# EasyEDA Pro project skyrizz_e32_se050.epro, schematic Schematic1_8

## Sheets
1 MCU & MEMORY: Board Name: ESP32-S3_TFT; Create Date: 2026-02-07; Page Name: MCU & MEMORY; Project Name: S3 SuperMini LCD; Schematic Name: Schematic1_4; Update Date: 2026-02-18; Company: EasyEDA.com; Page Size: A4; Version: V1.0
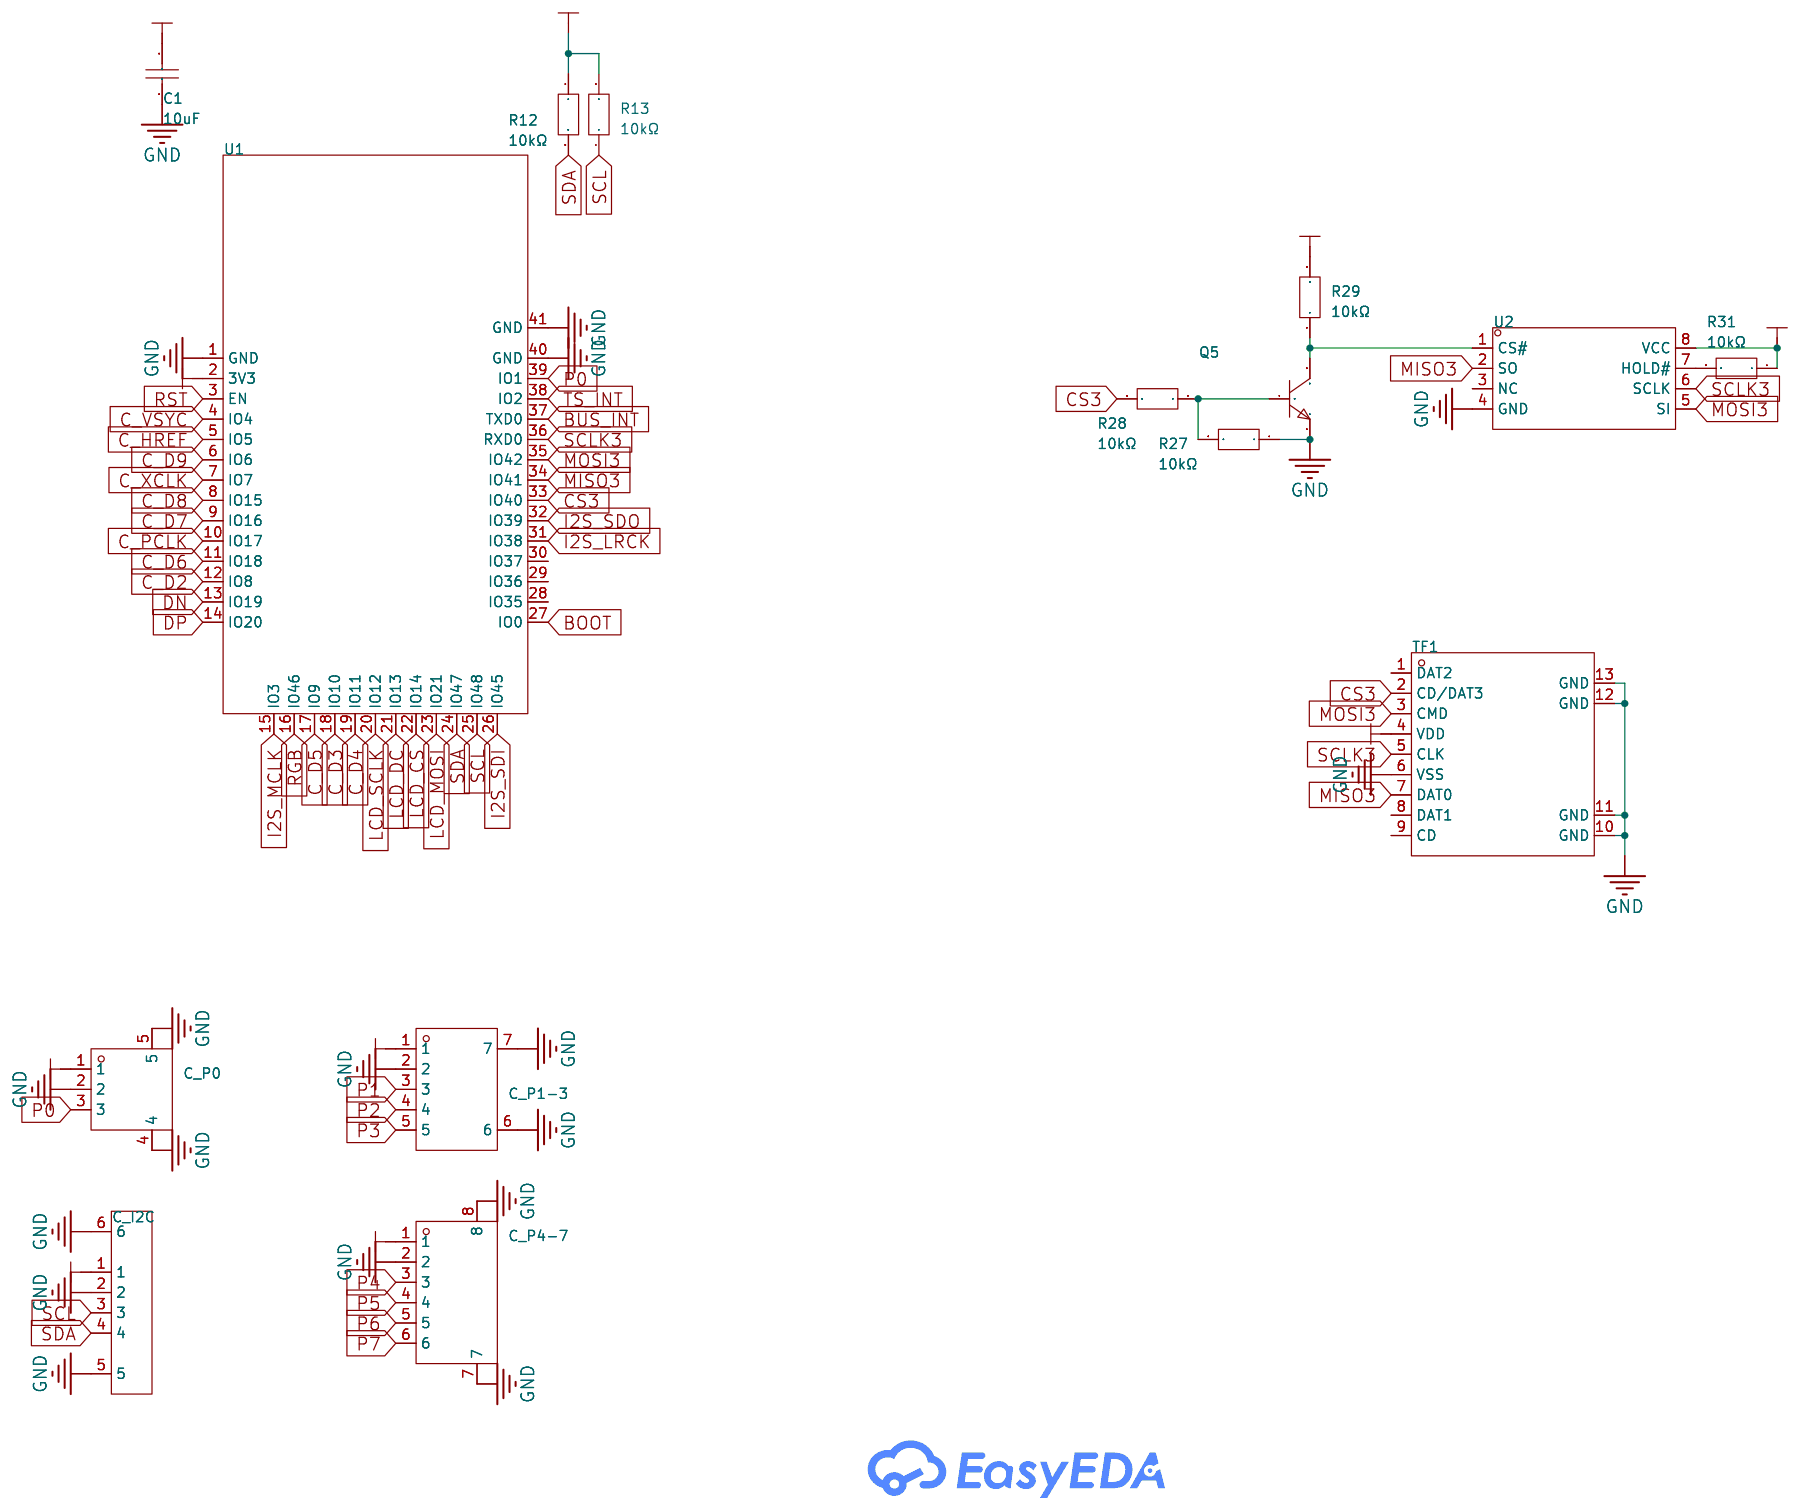
[diagram p0: MCU & MEMORY]
2 POWER: Create Date: 2026-02-15; Page Name: POWER; Update Date: 2026-02-19
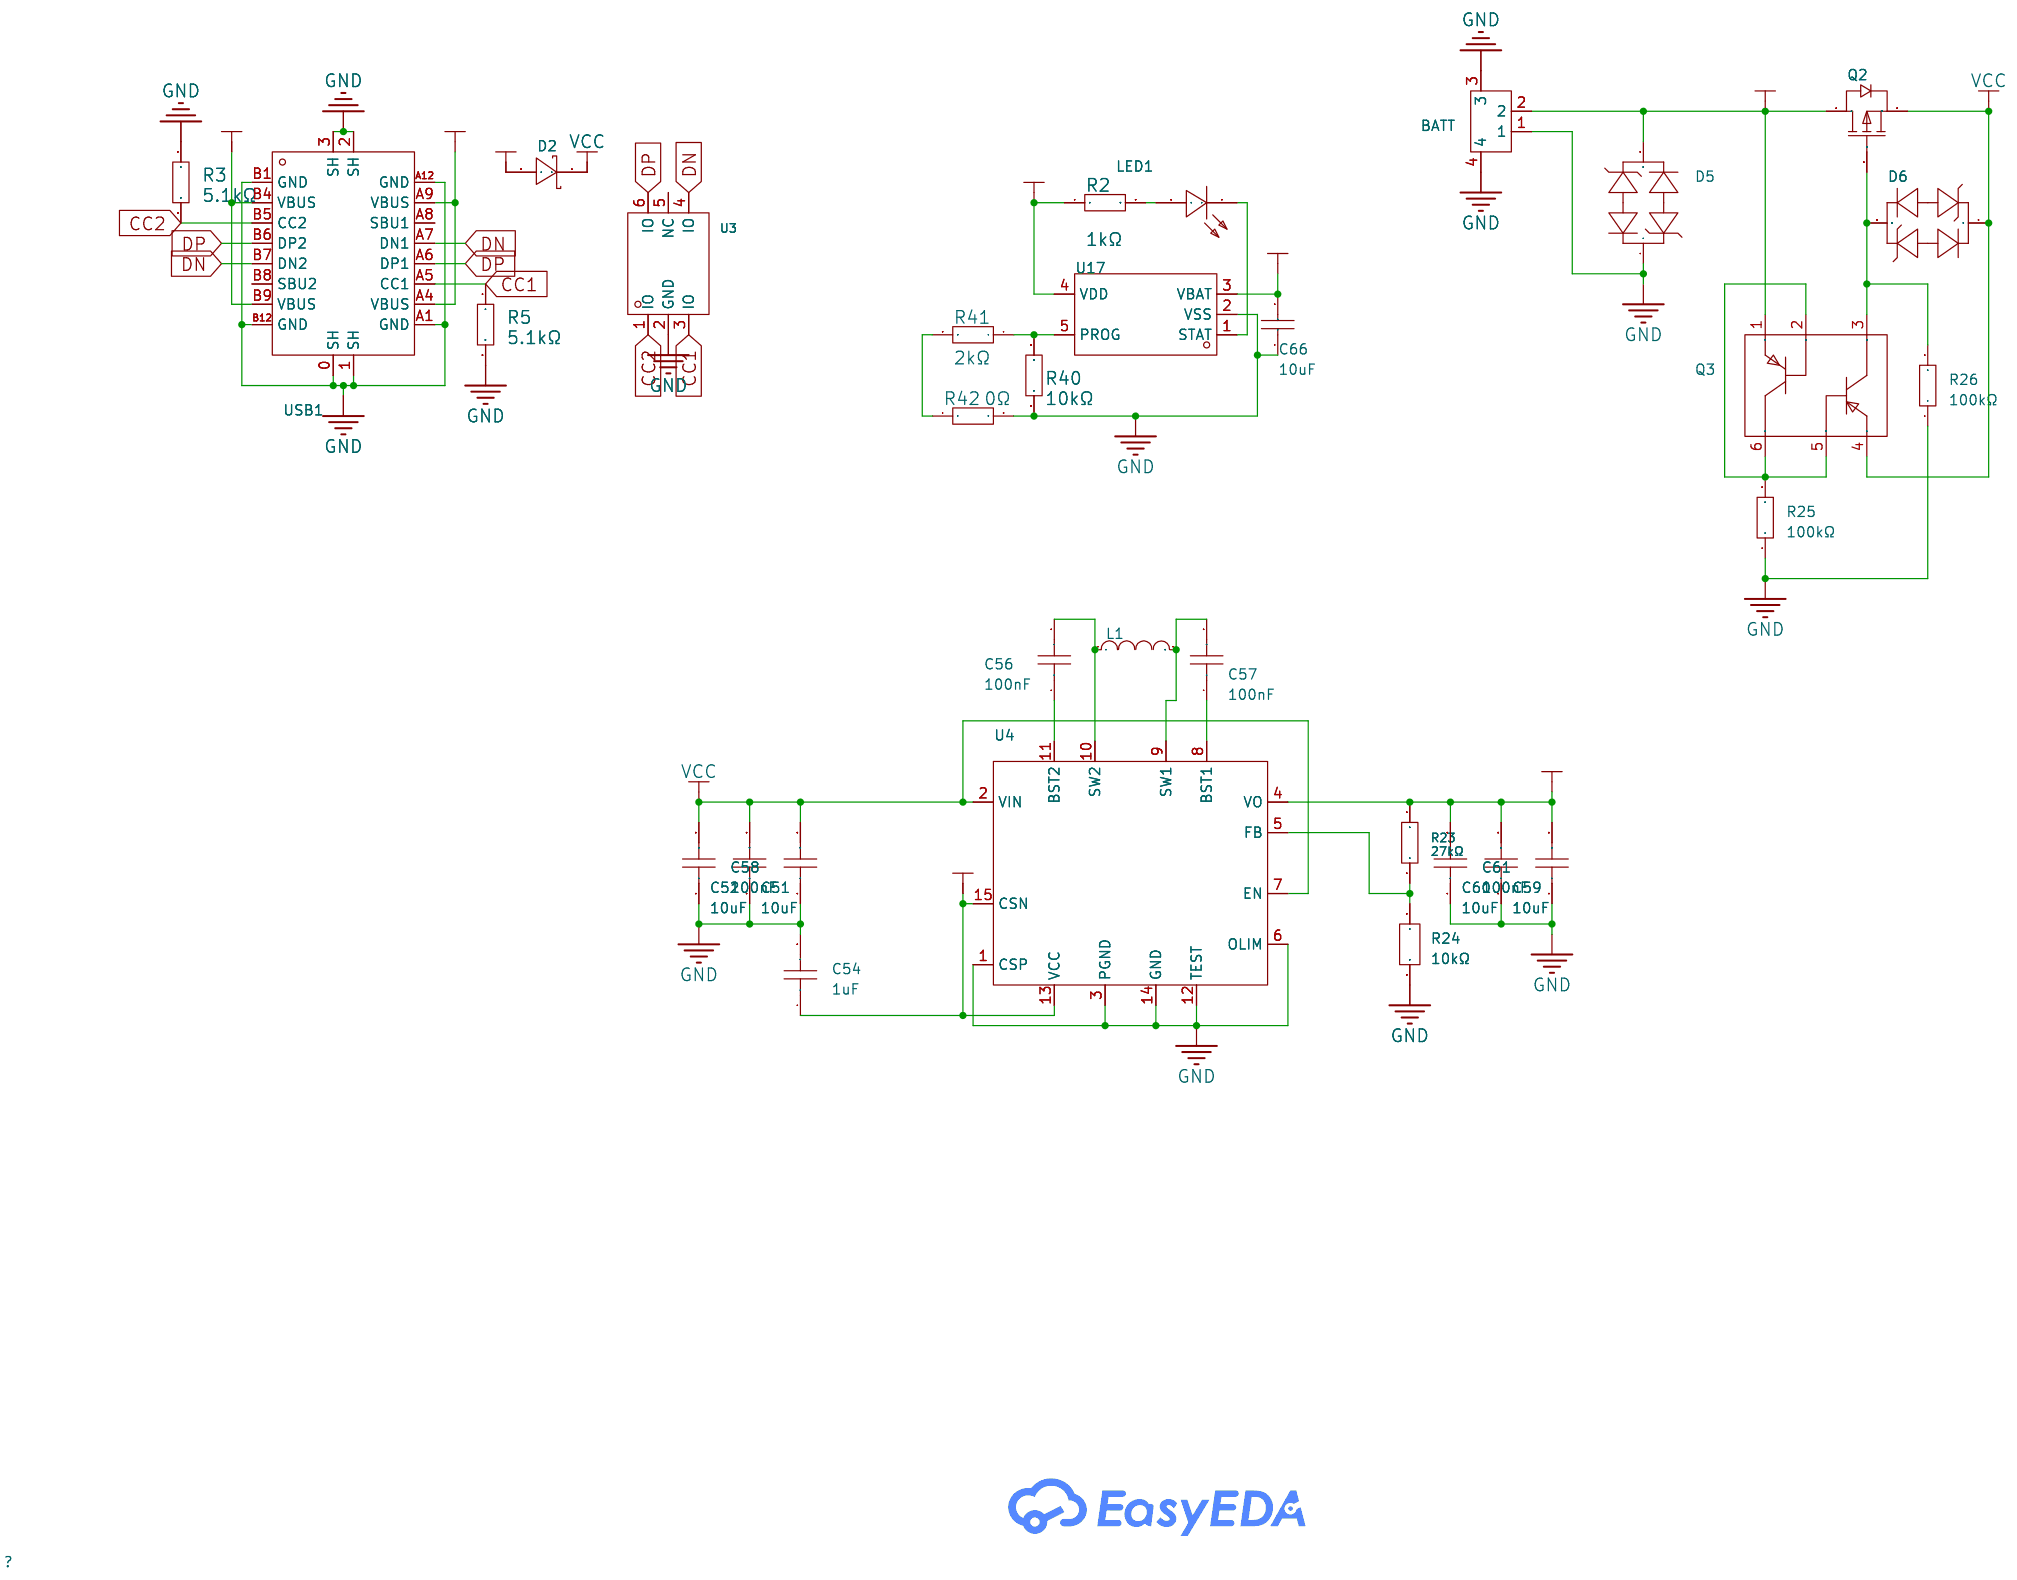
[diagram p1: POWER]
3 SENSOR I2C: Board Name: skyrizz_e32; Create Date: 2026-02-26; Page Name: SENSOR I2C; Schematic Name: Schematic1_8; Update Date: 2026-02-26
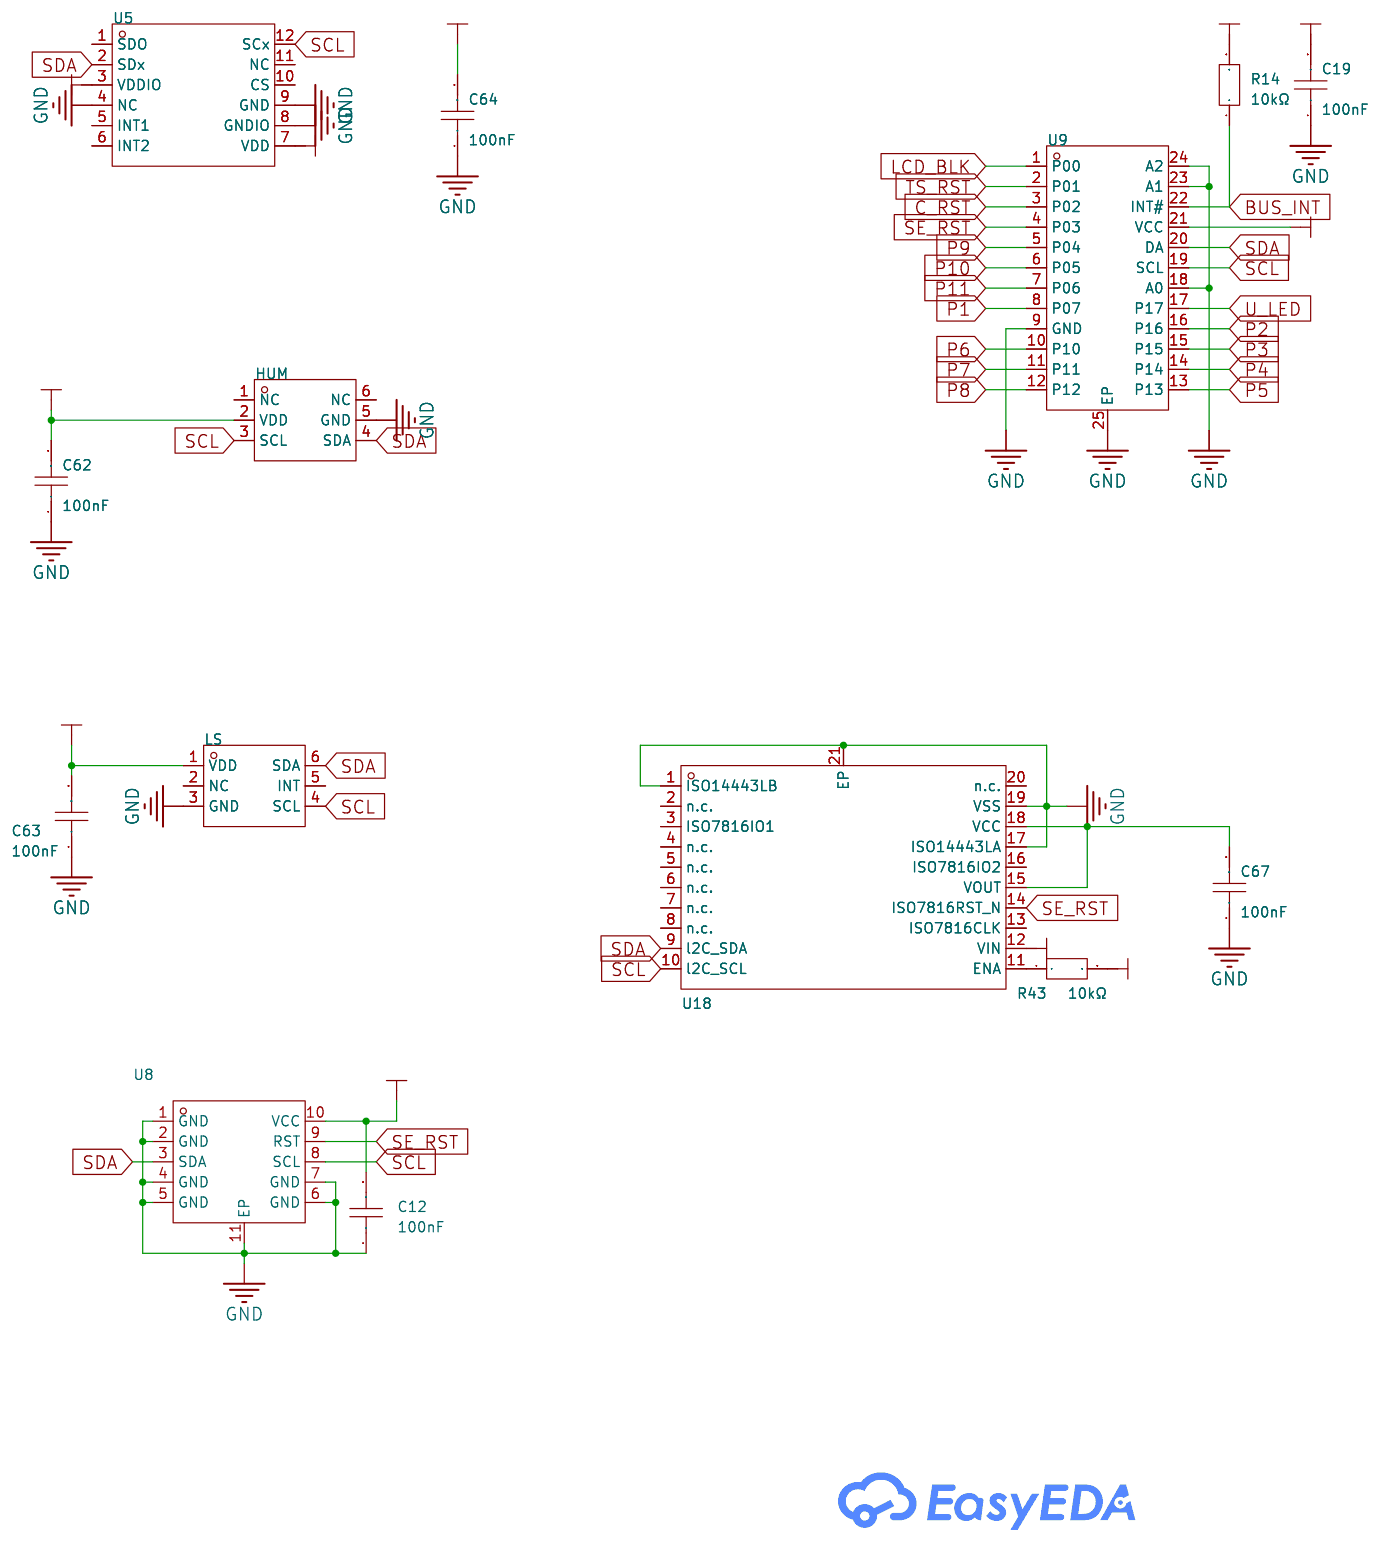
[diagram p2: SENSOR I2C]
4 LCD & CAM: Create Date: 2026-02-15; Page Name: LCD & CAM; Update Date: 2026-02-15
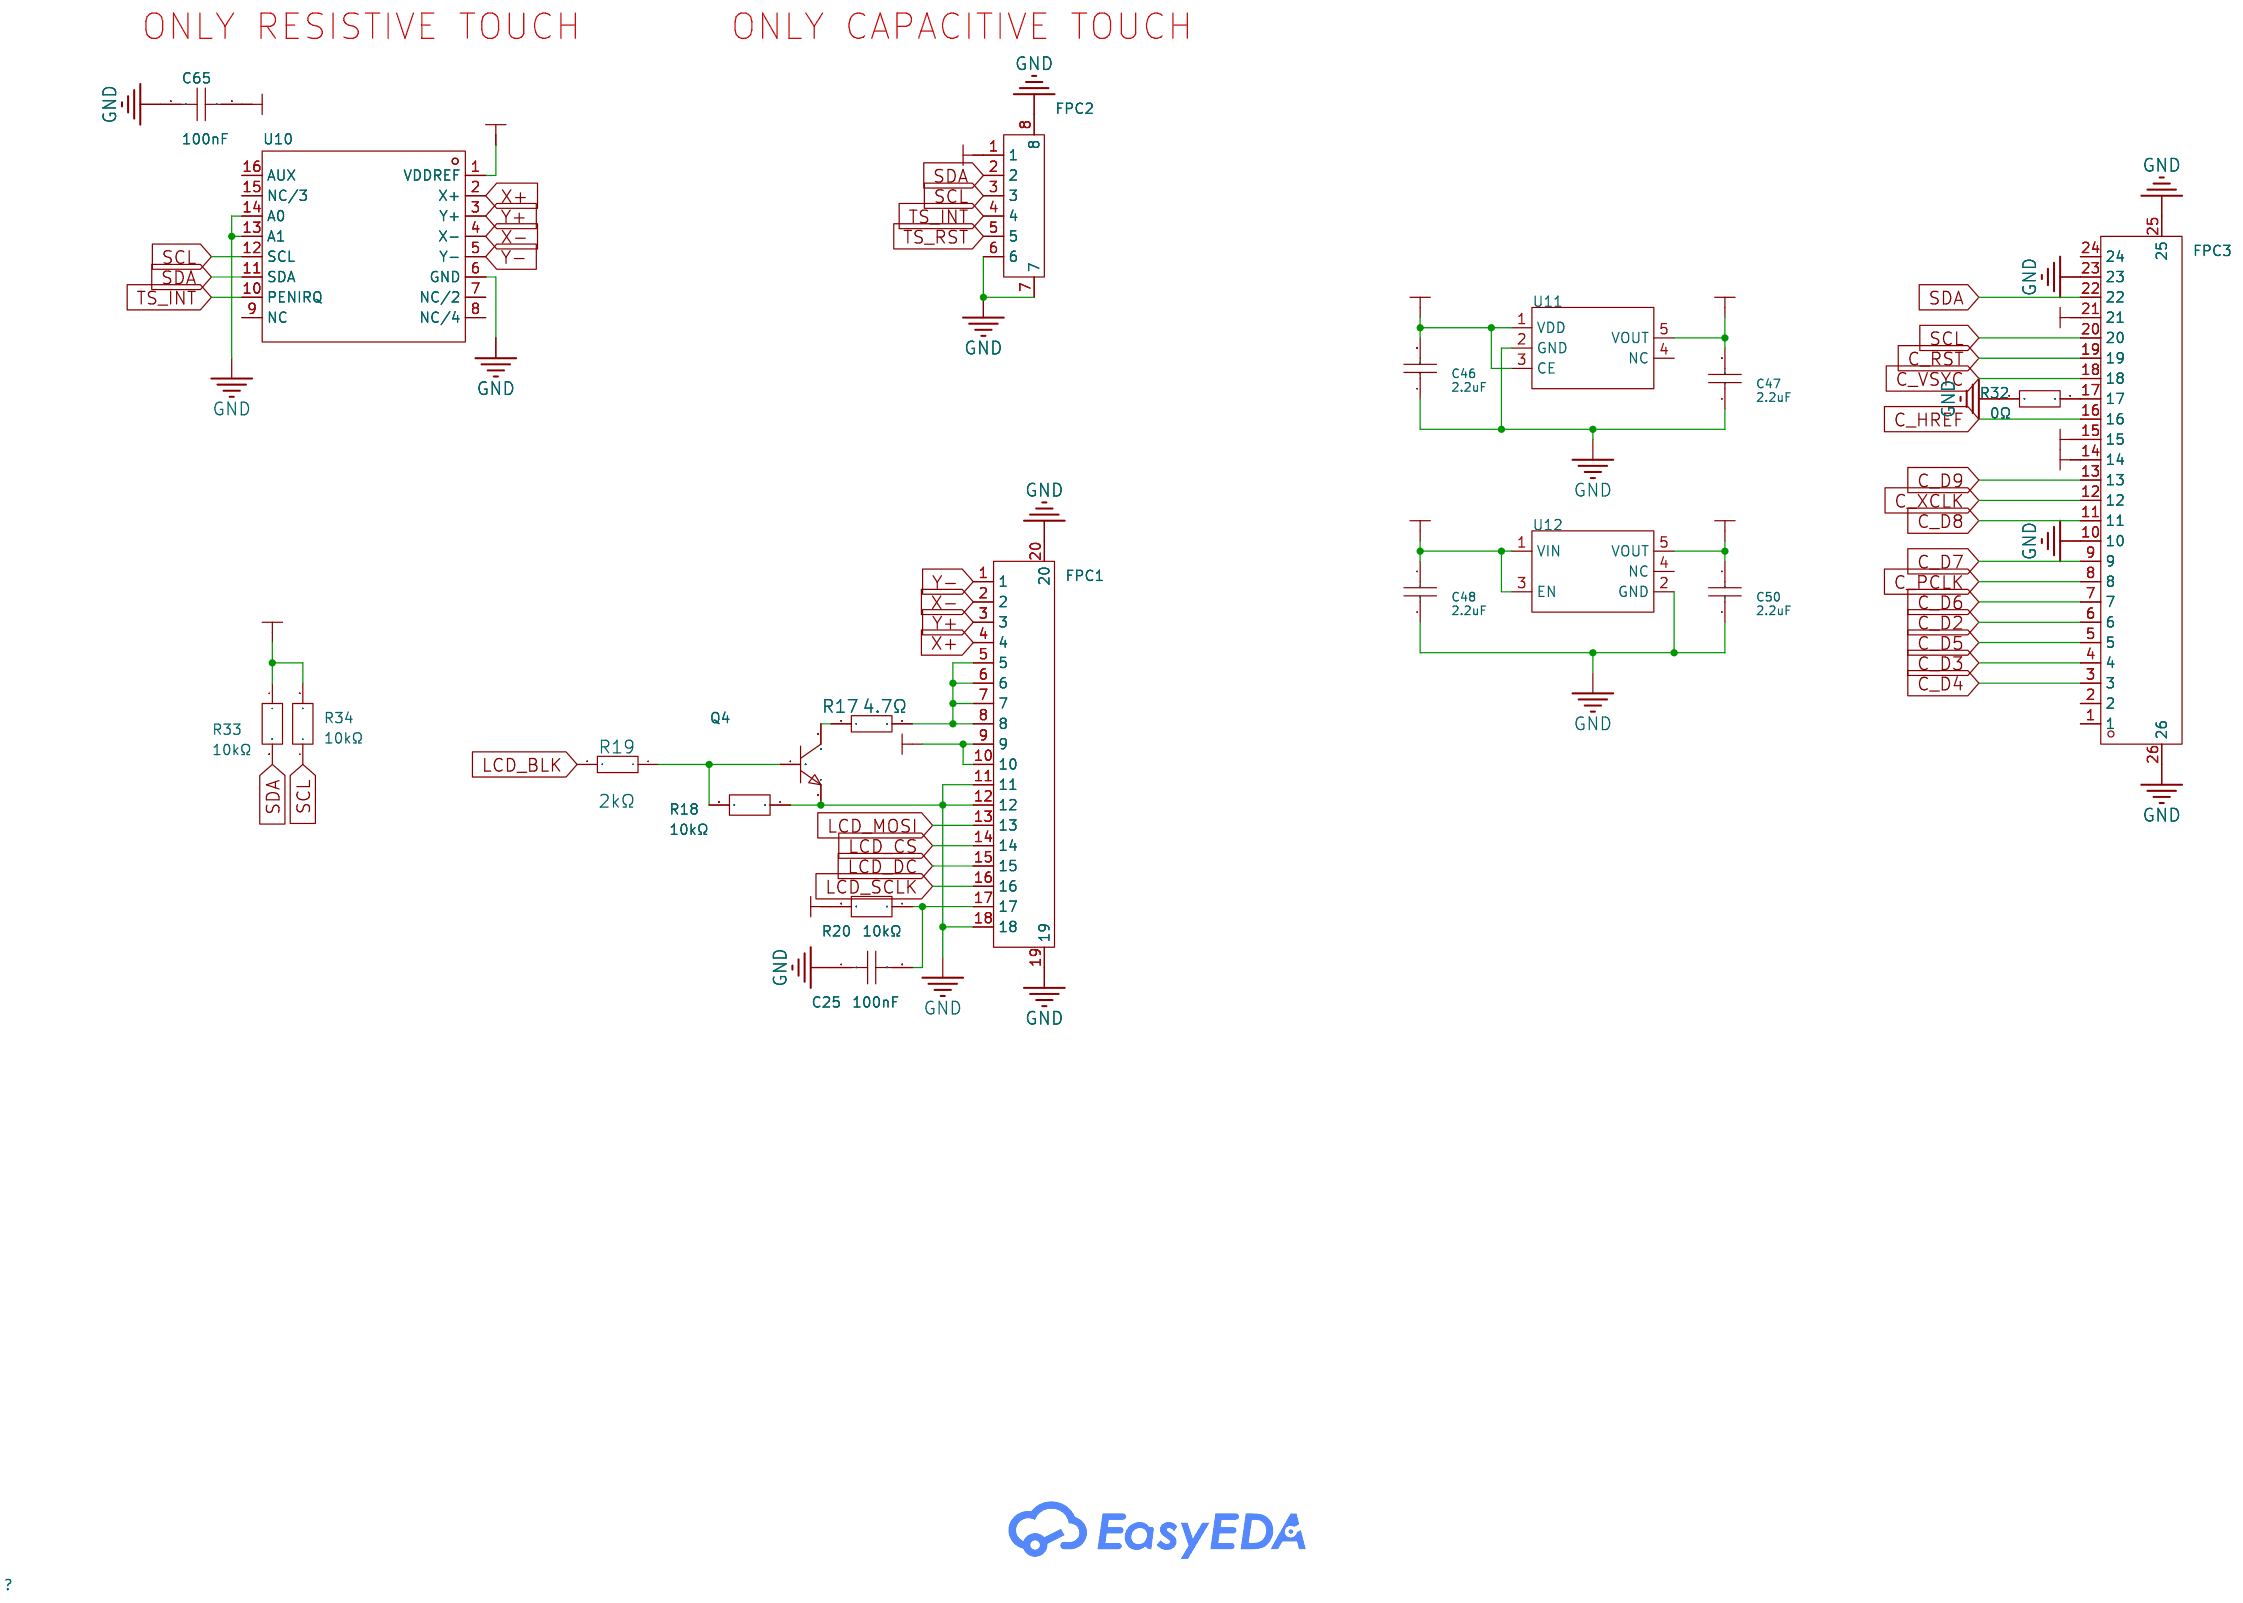
[diagram p3: LCD & CAM]
5 BUTTON & IND: Create Date: 2026-02-15; Page Name: BUTTON & IND
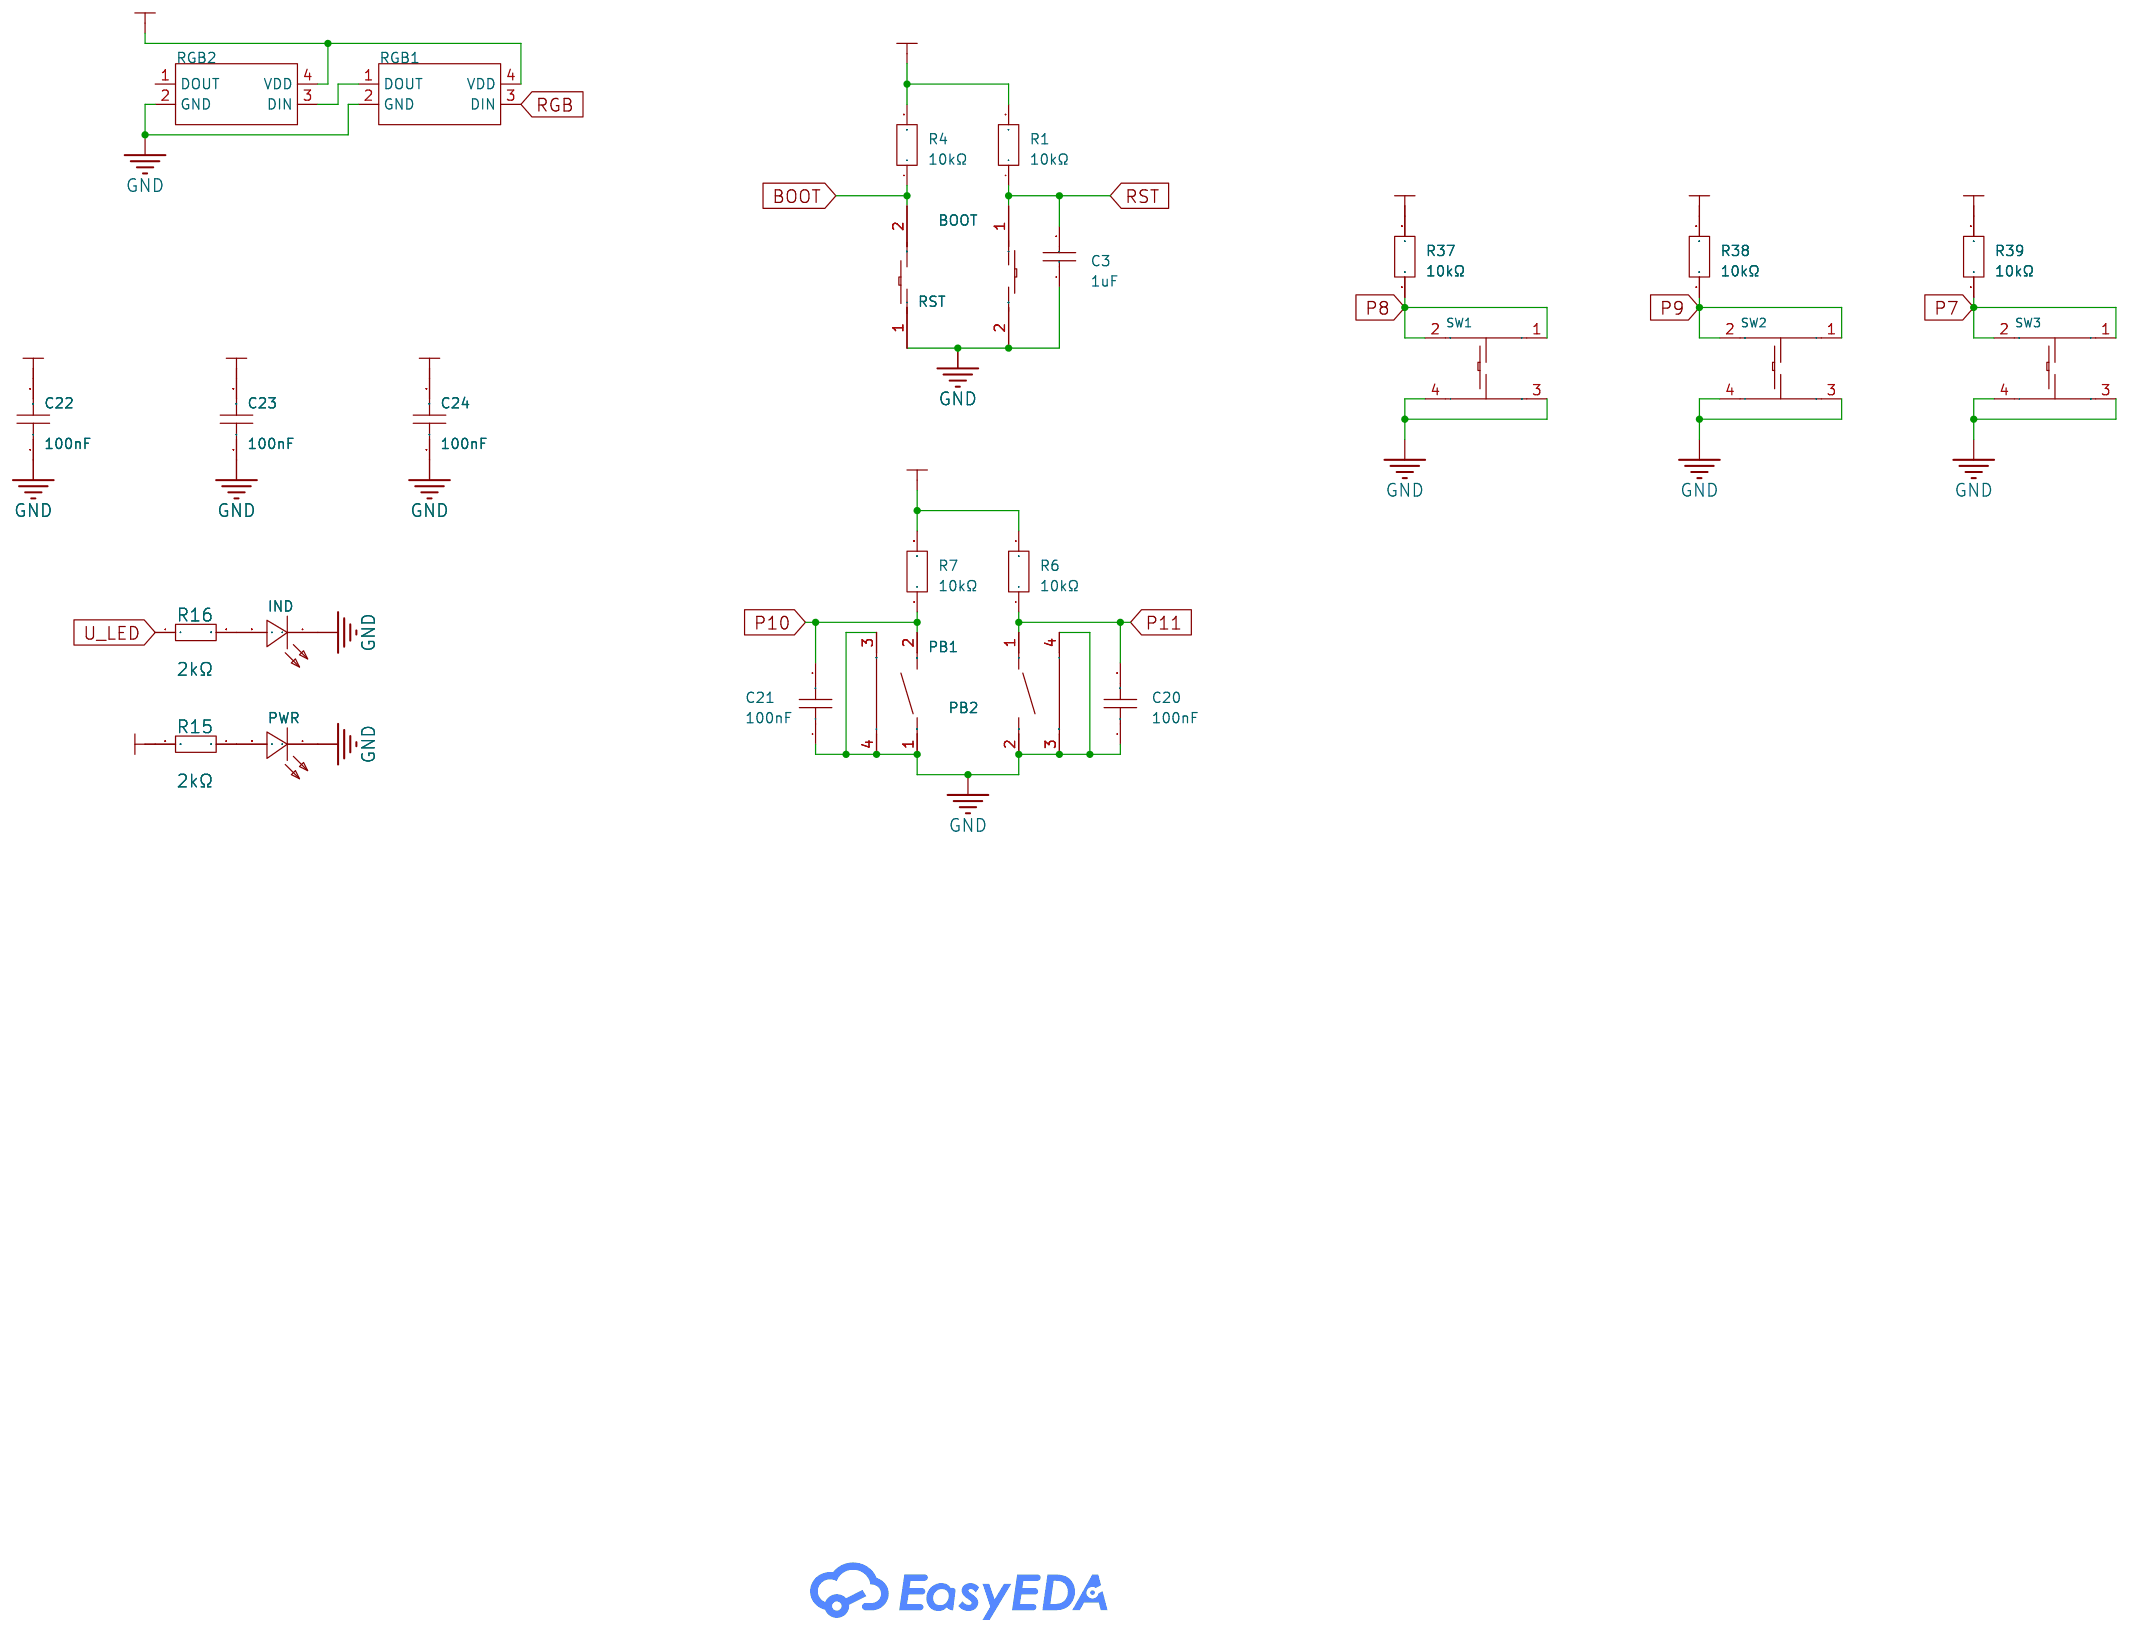
[diagram p4: BUTTON & IND]
6 MIC & SPEAKER: Create Date: 2026-02-15; Page Name: MIC & SPEAKER; Update Date: 2026-02-16
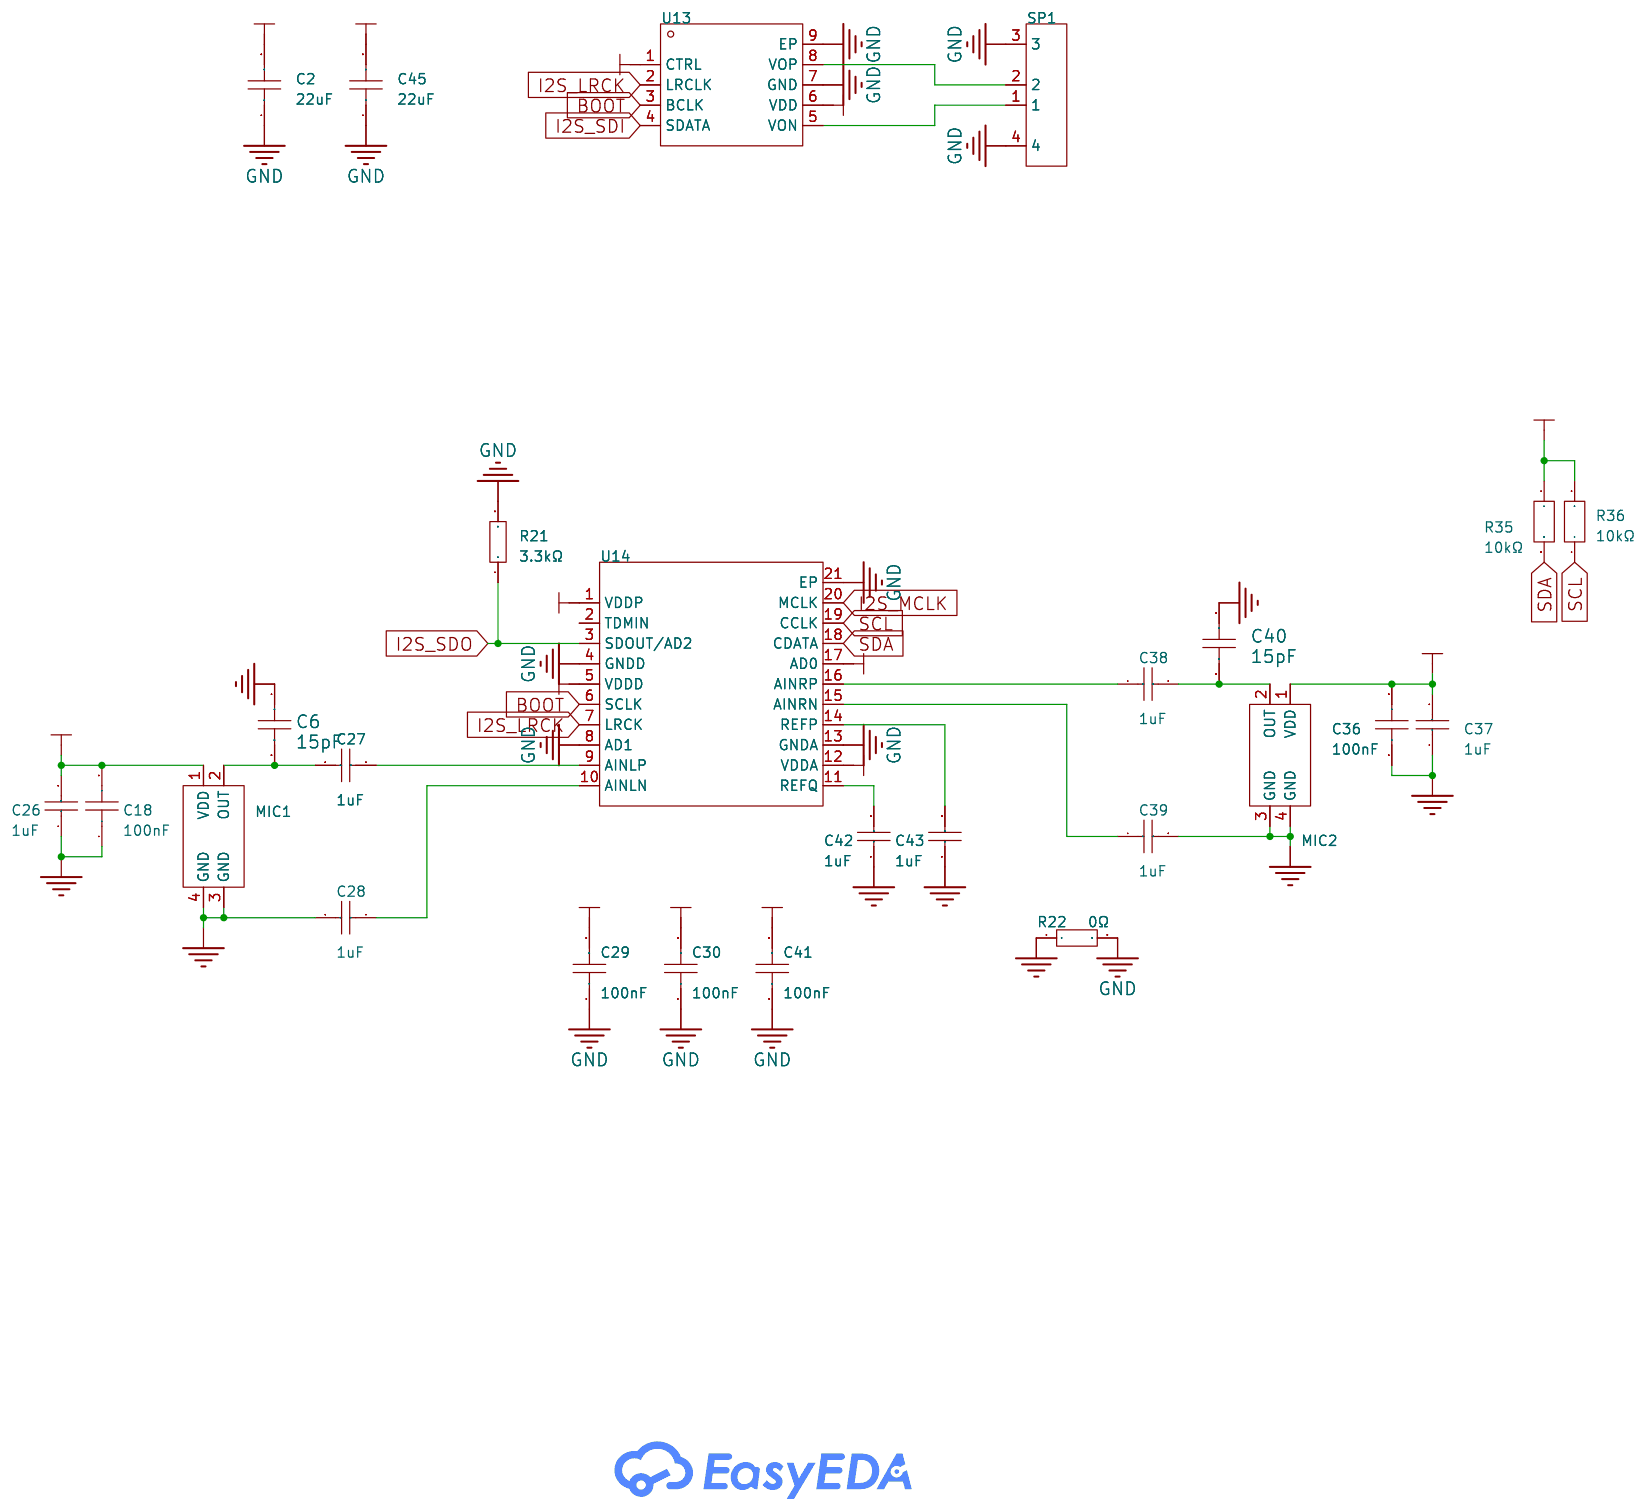
[diagram p5: MIC & SPEAKER]

## Parts
sheet BUTTON & IND
BOOT  B3U-1000P  [KEY-SMD_B3U-1000PM]
C3  1uF  [C0201]
C20  100nF  [C0201]
C21  100nF  [C0201]
C22  100nF  [C0201]
C23  100nF  [C0201]
C24  100nF  [C0201]
IND  KT-0603YG  [LED0603-RD]
PB1  TS24CA  [SW-SMD_2P-TS24CA]
PB2  TS24CA  [SW-SMD_2P-TS24CA]
PWR  KT-0603R  [LED0603-RD]
R1  10kΩ  [R0201]
R4  10kΩ  [R0201]
R6  10kΩ  [R0201]
R7  10kΩ  [R0201]
R15  2kΩ  [R0201]
R16  2kΩ  [R0201]
R37  10kΩ  [R0201]
R38  10kΩ  [R0201]
R39  10kΩ  [R0201]
RGB1  XL-0807RGBC-2812B  [LED-SMD_4P-L2.0-W1.8_XL-0807RGBC-WS2812B]
RGB2  XL-0807RGBC-2812B  [LED-SMD_4P-L2.0-W1.8_XL-0807RGBC-WS2812B]
RST  B3U-1000P  [KEY-SMD_B3U-1000PM]
SW1  EVQQ2B03W  [KEY-SMD_4P-L6.5-W6.0-P4.0-LS6.6]
SW2  EVQQ2B03W  [KEY-SMD_4P-L6.5-W6.0-P4.0-LS6.6]
SW3  EVQQ2B03W  [KEY-SMD_4P-L6.5-W6.0-P4.0-LS6.6]
sheet LCD & CAM
C25  100nF  [C0201]
C46  2.2uF  [C0201]
C47  2.2uF  [C0201]
C48  2.2uF  [C0201]
C50  2.2uF  [C0201]
C65  100nF  [C0201]
FPC1  FPC-0.5FX-18PWBH15  [FPC-SMD_18P-P0.50_XUNPU_FPC-0.5FX-18PWBH15]
FPC2  FPC06-T1T1-2021-A  [FPC-SMD_FPC06-T1T1-2021-A]
FPC3  FPC-0.5FX-24PH20  [FPC-SMD_24P-P0.50_YUANDI_FPC-0.5FX-24PH20]
Q4  MMBT3904  [SOT-23-3_L2.9-W1.3-P1.90-LS2.4-BR]
R17  4.7Ω  [R0603]
R18  10kΩ  [R0201]
R19  2kΩ  [R0201]
R20  10kΩ  [R0201]
R32  0Ω  [R0603]
R33  10kΩ  [R0201]
R34  10kΩ  [R0201]
U10  TSC2007IPWR  [TSSOP-16_L5.0-W4.4-P0.65-LS6.4-BL]
U11  BL8555-28PRA  [SOT-23-5_L3.0-W1.7-P0.95-LS2.8-BL]
U12  AP7343Q-18W5-7  [SOT-23-5_L3.0-W1.7-P0.95-LS2.8-BR]
sheet MCU & MEMORY
C1  10uF  [C0402]
C_I2C  SM04B-SRSS-TB(LF)(SN)  [CONN-SMD_4P-P1.00_SM04B-SRSS-TB-LF-SN]
C_P0  SM03B-SRSS-TB(LF)(SN)  [CONN-SMD_SM03B-SRSS-TB-LF-SN-P]
C_P1-3  SM05B-SRSS-TB(LF)(SN)  [CONN-SMD_SM05B-SRSS-TB-LF-SN]
C_P4-7  SM06B-SRSS-TB(LF)(SN)  [CONN-SMD_SM06B-SRSS-TB-LF-SN]
Q5  MMBT3904  [SOT-23-3_L2.9-W1.3-P1.90-LS2.4-BR]
R12  10kΩ  [R0201]
R13  10kΩ  [R0201]
R27  10kΩ  [R0201]
R28  10kΩ  [R0201]
R29  10kΩ  [R0201]
R31  10kΩ  [R0201]
TF1  TF-CARD H1.8  [TF-SMD_TF-CARD-H1.8]
U1  ESP32-S3-WROOM-1-N16R8  [WIRELM-SMD_ESP32-S3-WROOM-1]
U2  GT30L24A3W  [SOIC-8_L5.3-W5.3-P1.27-LS8.0-BL]
sheet MIC & SPEAKER
C2  22uF  [C0402]
C6  15pF  [C0201]
C18  100nF  [C0201]
C26  1uF  [C0201]
C27  1uF  [C0201]
C28  1uF  [C0201]
C29  100nF  [C0201]
C30  100nF  [C0201]
C36  100nF  [C0201]
C37  1uF  [C0201]
C38  1uF  [C0201]
C39  1uF  [C0201]
C40  15pF  [C0201]
C41  100nF  [C0201]
C42  1uF  [C0201]
C43  1uF  [C0201]
C45  22uF  [C0402]
MIC1  MSM381ACP003  [MIC-SMD_4P-L2.8-W1.9-TR_MSM381ACP003]
MIC2  MSM381ACP003  [MIC-SMD_4P-L2.8-W1.9-TR_MSM381ACP003]
R21  3.3kΩ  [R0201]
R22  0Ω  [R0603]
R35  10kΩ  [R0201]
R36  10kΩ  [R0201]
SP1  SM02B-SRSS-TB(LF)(SN)  [CONN-SMD_2P-P1.00_SM02B-SRSS-TB-LF-SN]
U13  NS4168  [ESOP-8_L4.9-W3.9-P1.27-LS6.0-BL-EP]
U14  ES7243E  [QFN-20_L3.0-W3.0-P0.40-BL-EP1.7]
sheet POWER
BATT  PH-2P卧贴  [CONN-SMD_2P-P2.00_PH2.0-SPWB]
C51  10uF  [C0402]
C52  10uF  [C0402]
C54  1uF  [C0402]
C56  100nF  [C0402]
C57  100nF  [C0402]
C58  100nF  [C0402]
C59  10uF  [C0402]
C60  10uF  [C0402]
C61  100nF  [C0402]
C66  10uF  [C0402]
D2  SS34  [SMA_L4.3-W2.6-LS5.2-RD]
D5  PTVSUC3D5VB  [SOD-323_L1.8-W1.3-LS2.5-BI]
D6  PTVSUC3D5VB  [SOD-323_L1.8-W1.3-LS2.5-BI]
L1  2.2uH  [IND-SMD_L3.5-W3.0]
LED1  KT-0603R  [LED0603-RD]
Q2  AO3401A  [SOT-23-3_L2.9-W1.3-P1.90-LS2.4-BR_SMV2022-004LF]
Q3  BCM857BS  [SOT-363_L2.1-W1.3-P0.65-LS2.3-BL]
R2  1kΩ  [R0201]
R3  5.1kΩ  [R0201]
R5  5.1kΩ  [R0201]
R23  27kΩ  [R0201]
R24  10kΩ  [R0201]
R25  100kΩ  [R0201]
R26  100kΩ  [R0201]
R40  10kΩ  [R0201]
R41  2kΩ  [R0201]
R42  0Ω  [R0402]  (no BOM)
U3  PUSB2X4Y  [SOT-363-6_L2.0-W1.3-P0.65-LS2.1-BL]
U4  JW3651QFNE#TRPBF  [QFN-15_L4.0-W3.0_JW3655E]
U17  MCP73831T-2ACI/OT  [SOT-23-5_L3.0-W1.7-P0.95-LS2.8-BL]
USB1  USB-TYPE-C-018  [USB-C_SMD-TYPE-C-31-M-12]
sheet SENSOR I2C
C12  100nF  [C0201]
C19  100nF  [C0201]
C62  100nF  [C0201]
C63  100nF  [C0201]
C64  100nF  [C0201]
C67  100nF  [C0201]
HUM  AHT20  [SENSOR-SMD_L3.0-W3.0-P1.00-BR]
LS  LTR-303ALS-01  [TDFN-6_L2.0-W2.0-P0.65-BL]
R14  10kΩ  [R0201]
R43  10kΩ  [R0201]
U5  SC7A20HTR  [LGA-12_L2.0-W2.0-P0.50-TL]
U8  SLS32AIA020X2USON10  [USON-10_L3.0-W3.0-P0.50-BL-EP]
U9  XL9535QF24  [QFN-24_L4.0-W4.0-P0.50-BL-EP2.6]
U18  SE050C2HQ1/Z01SDZ  [WQFN-20_L3.0-W3.0-P0.40-BL-EP1.7]

## Library data of the parts
BOOT RST = B3U-1000P_C231329: Circuit:SPST Actuator Style:Round Button Operating Force:1.53N Mounting Type:Surface Mount,Vertical Length:3mm Width:2.5mm Switch Height:1.6mm Contact Current:50mA Voltage Rating:12V With Lamp:- Termination Style:SMD(SMT) Tab Life:- Operating Temperature:; LCSC Part Name: 3*2.5*1.6mm 立贴 轻触开关; Supplier Part: C231329; Manufacturer: OMRON(欧姆龙); Supplier Footprint: SMD,2.5x3mm; JLCPCB Part Class: Extended Part; Datasheet: https://item.szlcsc.com/datasheet/B3U-1000P/231216.html; Supplier: LCSC; Circuit: SPST; Actuator Style: Round Button; Operating Force: 1.53N; Mounting Type: Surface Mount,Vertical; Length: 3mm; Width: 2.5mm; Switch Height: 1.6mm; Contact Current: 50mA; Voltage Rating: 12V; Termination Style: SMD(SMT) Tab; Operating Temperature: -25℃~+70℃
C3 C26-C28 C37-C39 C42 C43 = CL03A105MQ3CSNH: Capacitance:1uF Tolerance:±20% Tolerance:±20% Voltage Rating:6.3V Temperature Coefficient:X5R; LCSC Part Name: 1uF ±20% 6.3V; Supplier Part: C53067; Manufacturer: SAMSUNG(三星); Supplier Footprint: 0201; JLCPCB Part Class: Extended Part; Datasheet: https://item.szlcsc.com/datasheet/CL03A105MQ3CSNH/54083.html; Supplier: LCSC; Tolerance: ±20%; Voltage Rating: 6.3V; Temperature Coefficient: X5R
C12 C18-C25 C29 C30 C36 C41 C62-C65 C67 = CL03A104KP3NNNC: Capacitance:100nF Tolerance:±10% Tolerance:±10% Voltage Rating:10V Temperature Coefficient:X5R; LCSC Part Name: 100nF ±10% 10V; Supplier Part: C49062; Manufacturer: SAMSUNG(三星); Supplier Footprint: 0201; JLCPCB Part Class: Extended Part; Datasheet: https://item.szlcsc.com/datasheet/CL03A104KP3NNNC/50070.html; Supplier: LCSC; Tolerance: ±10%; Voltage Rating: 10V; Temperature Coefficient: X5R
IND = KT-0603YG: Lamp Holder Type:- Illumination Color:Yellow Green Voltage - Forward(Vf):2V~2.2V Voltage - Forward(Vf):2V~2.2V Power(Watts):40mW Forward Current:20mA Wavelength - Dominant:567nm~573nm Wavelength - Dominant:567nm~573nm Peak Wavelength:- Diode Configuration; LCSC Part Name: 0603 黄绿 普绿; Supplier Part: C2289; Manufacturer: KENTO; Supplier Footprint: 0603; JLCPCB Part Class: Extended Part; Datasheet: https://item.szlcsc.com/datasheet/KT-0603YG/2662.html; Supplier: LCSC; Illumination Color: Yellow Green; Voltage - Forward(Vf): 2V~2.2V; Power(Watts): 40mW; Forward Current: 20mA; Wavelength - Dominant: 567nm~573nm; Diode Configuration: Discrete Diode; Lens Color: Water Clear; Luminous Intensity: 30mcd~42mcd; Viewing Angle: 120°; Mounting Style: op View Mount; Operating Temperature: -40℃~+85℃
PB1 PB2 = TS24CA: Circuit:SPST Actuator Style:Rectangular Button Mounting Type:Surface Mount, Right Angle Length:4.55mm Width:1.8mm Switch Height:3.5mm Contact Current:50mA Voltage Rating:12V With Lamp:- Life:-; LCSC Part Name: 4.55*1.8*3.5mm 卧贴 轻触开关; Supplier Part: C393942; Manufacturer: SHOU HAN(首韩); Supplier Footprint: SMD,4.6x1.8mm; JLCPCB Part Class: Extended Part; Datasheet: https://item.szlcsc.com/datasheet/TS24CA/372554.html; Supplier: LCSC; Circuit: SPST; Actuator Style: Rectangular Button; Mounting Type: Surface Mount, Right Angle; Length: 4.55mm; Width: 1.8mm; Switch Height: 3.5mm; Contact Current: 50mA; Voltage Rating: 12V
LED1 PWR = KT-0603R: Emitted Color:Red Power Dissipation:- Forward Current:- Dominant Wavelength:- Dominant Wavelength:- Peak Wavelength:- Diode Configuration:- Lens Color:- Color Temperature:- Color Temperature:- Viewing Angle:- Mounting Sytle:- Operating Temperature:-40℃~+8; LCSC Part Name: 0603 红灯 高亮; Supplier Part: C2286; Manufacturer: KENTO; Supplier Footprint: 0603; JLCPCB Part Class: Basic Part; Datasheet: https://atta.szlcsc.com/upload/public/pdf/source/20160616/1466072038404.pdf; Supplier: LCSC; Emitted Color: Red; Operating Temperature: -40℃~+85℃
R1 R4 R6 R7 R12-R14 R18 R20 R24 R27-R29 R31 R33-R40 R43 = 0201WMF1002TEE: Type:Thick Film Resistors Resistance:10kΩ Tolerance:±1% Tolerance:±1% Power(Watts): Overload Voltage (Max): Temperature Coefficient:±200ppm/℃ Temperature Coefficient:±200ppm/℃ Operating Temperature Range:-55℃~+155℃ Operating Temperature Range:-55℃~+155℃; LCSC Part Name: 10kΩ ±1% 50mW 厚膜电阻; Supplier Part: C473048; Manufacturer: UNI-ROYAL(厚声); Supplier Footprint: 0201; JLCPCB Part Class: Extended Part; Datasheet: https://atta.szlcsc.com/upload/public/pdf/source/20200306/C422600_1E6D84923E4A46A82E41ADD87F860B5C.pdf; Supplier: LCSC; Type: Thick Film Resistors; Tolerance: ±1%; Temperature Coefficient: ±200ppm/℃; Operating Temperature Range: -55℃~+155℃
R15 R16 R19 R41 = 0201WMF2001TEE: Type:Thick Film Resistor Resistance:2kΩ Tolerance:±1% Tolerance:±1% Power(Watts):50mW Voltage-Supply(Max):25V Temperature Coefficient:±200ppm/℃ Temperature Coefficient:±200ppm/℃ Operating Temperature:-55℃~+155℃ Operating Temperature:-55℃~+155℃; LCSC Part Name: 2kΩ ±1% 50mW 厚膜电阻; Supplier Part: C270358; Manufacturer: UNI-ROYAL(厚声); Supplier Footprint: 0201; JLCPCB Part Class: Extended Part; Datasheet: https://item.szlcsc.com/datasheet/0201WMF2001TEE/259888.html; Supplier: LCSC; Type: Thick Film Resistor; Tolerance: ±1%; Power(Watts): 50mW; Voltage-Supply(Max): 25V; Temperature Coefficient: ±200ppm/℃; Operating Temperature: -55℃~+155℃
RGB1 RGB2 = XL-0807RGBC-2812B: Wavelength:R:620nm~630nm；G:520nm~530nm；B:460nm~475nm Luminous Intensity:R:200mcd；G:800mcd；B:300mcd Fixed-Frequency Pwm Mode:4.5kHz Data Transmission Rate:800Kbit/s Voltage - Supply:4V~5.5V Voltage - Supply:4V~5.5V Quiescent Current:0.35mA Lens Color:Water; LCSC Part Name: XL-0807RGBC-WS2812B; Supplier Part: C3646929; Manufacturer: XINGLIGHT(成兴光); Supplier Footprint: SMD-4P,2x1.8mm; JLCPCB Part Class: Extended Part; Datasheet: https://item.szlcsc.com/datasheet/XL-0807RGBC-2812B/4213772.html; Supplier: LCSC; Wavelength: R:620nm~630nm；G:520nm~530nm；B:460nm~475nm; Luminous Intensity: R:200mcd；G:800mcd；B:300mcd; Fixed-Frequency Pwm Mode: 4.5kHz; Data Transmission Rate: 800Kbit/s; Voltage - Supply: 4V~5.5V; Quiescent Current: 0.35mA; Lens Color: Water Clear; ESD Withstand Voltage: 3000V; Installation method: op View Mount; Operating Temperature: -20℃~+85℃; Peak Wavelength: R:625nm；B:470nm；G:525nm; Viewing Angle: 120°; Length: 2mm; Width: 0.8mm; Height: 1.8mm
SW1-SW3 = EVQQ2B03W: Circuit:SPST Actuator Style:Round Button Operating Force:0.5N Mounting Style:Brick nogging Switch Length:6.5mm Switch Width:6mm Switch Height:3.1mm Contact Current:20mA Voltage Rating (AC):- Voltage Rating (DC):15V Power Rating:- Insulation Resistance:100; LCSC Part Name: 6.5*6*3.1mm 立贴 轻触开关; Supplier Part: C79178; Manufacturer: PANASONIC(松下); Supplier Footprint: SMD,6x6.5mm; JLCPCB Part Class: Extended Part; Datasheet: https://atta.szlcsc.com/upload/public/pdf/source/20160718/1468827520784.pdf; Supplier: LCSC; Circuit: SPST; Actuator Style: Round Button; Operating Force: 0.5N; Mounting Style: Brick nogging; Switch Length: 6.5mm; Switch Width: 6mm; Switch Height: 3.1mm; Contact Current: 20mA; Voltage Rating (DC): 15V; Insulation Resistance: 100MΩ; Pin Style: J pin; Mechanical Life: 200万次; Operating Temperature: -40℃~+85℃
C46-C48 C50 = GRM033R60J225ME47D: Capacitance:2.2uF Tolerance:±20% Tolerance:±20% Voltage Rating:6.3V Temperature Coefficient:X5R; LCSC Part Name: 2.2uF ±20% 6.3V; Supplier Part: C76933; Manufacturer: muRata(村田); Supplier Footprint: 0201; JLCPCB Part Class: Extended Part; Datasheet: https://item.szlcsc.com/datasheet/GRM033R60J225ME47D/78060.html; Supplier: LCSC; Tolerance: ±20%; Voltage Rating: 6.3V; Temperature Coefficient: X5R
FPC1 = FPC-0.5FX-18PWBH15: Locking Feature:Hinged Lid Contact Type:Bottom Contact Number of Contacts:18P Pitch:0.5mm Mounting Type:Surface Mount, Right Angle FFC, FCB Thickness:0.3mm FFC, FCB Thickness:0.3mm Height Above Board:1.5mm Contact Material:Phosphor Bronze Contact Plating:; LCSC Part Name: 翻盖式 下接 P数:18P 间距:0.5mm; Supplier Part: C3446030; Manufacturer: XUNPU(讯普); Supplier Footprint: SMD,P=0.5mm; JLCPCB Part Class: Extended Part; Datasheet: https://item.szlcsc.com/datasheet/FPC-0.5FX-18PWBH15/4012026.html; Supplier: LCSC; Locking Feature: Hinged Lid; Contact Type: Bottom Contact; Number of Contacts: 18P; Pitch: 0.5mm; Mounting Type: Surface Mount, Right Angle; FFC, FCB Thickness: 0.3mm; Height Above Board: 1.5mm; Contact Material: Phosphor Bronze; Contact Plating: Tin; Operating Temperature: -25℃~+85℃; Rated Voltage (Max): 50V; Current Rating (Max): 500mA
FPC2 = FPC06-T1T1-2021-A: Locking Feature:Hinged Lid Contact Type:Bottom Contact Number of Contacts:6P Pitch:0.5mm Mounting Type:Surface Mount, Right Angle FFC, FCB Thickness:0.3mm FFC, FCB Thickness:0.3mm Height Above Board:1.5mm Contact Material:Copper Contact Plating:Tin Rated; LCSC Part Name: 翻盖式 下接 P数:6P 间距:0.5mm; Supplier Part: C52740858; Manufacturer: SHETIME(高钺达); Supplier Footprint: SMD,P=0.5mm,卧贴; JLCPCB Part Class: Extended Part; Datasheet: https://item.szlcsc.com/datasheet/FPC06-T1T1-2021-A/55627474.html; Supplier: LCSC; Locking Feature: Hinged Lid; Contact Type: Bottom Contact; Number of Contacts: 6P; Pitch: 0.5mm; Mounting Type: Surface Mount, Right Angle; FFC, FCB Thickness: 0.3mm; Height Above Board: 1.5mm; Contact Material: Copper; Contact Plating: Tin; Rated Voltage (Max): 50V
FPC3 = FPC-0.5FX-24PH20: Locking Feature:Hinged Lid Contact Type:Bottom Contact Number of Contacts:24P Pitch:0.5mm Mounting Type:Surface Mount, Right Angle FFC, FCB Thickness:0.3mm FFC, FCB Thickness:0.3mm Height Above Board:2mm Contact Material:Phosphor Bronze Contact Plating:Ti; LCSC Part Name: 翻盖式 下接 P数:24P 间距:0.5mm; Supplier Part: C19077718; Manufacturer: Yuandi(元迪); Supplier Footprint: SMD,P=0.5mm; JLCPCB Part Class: Extended Part; Datasheet: https://item.szlcsc.com/datasheet/FPC-0.5FX-24PH20/20275811.html; Supplier: LCSC; Locking Feature: Hinged Lid; Contact Type: Bottom Contact; Number of Contacts: 24P; Pitch: 0.5mm; Mounting Type: Surface Mount, Right Angle; FFC, FCB Thickness: 0.3mm; Height Above Board: 2mm; Contact Material: Phosphor Bronze; Contact Plating: Tin; Operating Temperature: -25℃~+85℃; Rated Voltage (Max): 50V; Current Rating (Max): 500mA
Q4 Q5 = MMBT3904_C22374713: Supplier Part: C22374713; Manufacturer: DOWO(东沃); Supplier Footprint: SOT-23; JLCPCB Part Class: Extended Part; Datasheet: https://atta.szlcsc.com/upload/public/pdf/source/20240402/5DDCD9F172A0F6C20D9FAF0C25C6F6AF.pdf; Supplier: LCSC
R17 = 0603WAF470KT5E: Type:Thick Film Resistor Resistance:4.7Ω Tolerance:±1% Tolerance:±1% Power(Watts):100mW Voltage-Supply(Max):75V Temperature Coefficient:±400ppm/℃ Temperature Coefficient:±400ppm/℃ Operating Temperature:-55℃~+155℃ Operating Temperature:-55℃~+155℃; LCSC Part Name: 4.7Ω ±1% 100mW 厚膜电阻; Supplier Part: C23164; Manufacturer: UNI-ROYAL(厚声); Supplier Footprint: 0603; JLCPCB Part Class: Basic Part; Datasheet: https://item.szlcsc.com/datasheet/0603WAF470KT5E/23891.html; Supplier: LCSC; Type: Thick Film Resistor; Tolerance: ±1%; Power(Watts): 100mW; Voltage-Supply(Max): 75V; Temperature Coefficient: ±400ppm/℃; Operating Temperature: -55℃~+155℃
R22 R32 = 0603WAF0000T5E: Type:Thick Film Resistor Resistance:0Ω Tolerance:±1% Tolerance:±1% Power(Watts):100mW Voltage-Supply(Max):75V Temperature Coefficient:- Temperature Coefficient:- Operating Temperature:-55℃~+155℃ Operating Temperature:-55℃~+155℃; LCSC Part Name: 0Ω ±1% 100mW 厚膜电阻; Supplier Part: C21189; Manufacturer: UNI-ROYAL(厚声); Supplier Footprint: 0603; JLCPCB Part Class: Basic Part; Datasheet: https://item.szlcsc.com/datasheet/0603WAF0000T5E/21903.html; Supplier: LCSC; Type: Thick Film Resistor; Tolerance: ±1%; Power(Watts): 100mW; Voltage-Supply(Max): 75V; Operating Temperature: -55℃~+155℃
U10 = TSC2007IPWR: Touch Screen Type:4-Wire Resistive Resolution (Bits):12 Interface:I2C Gain Error:±0.1LSB Gain Error:±0.1LSB Voltage - Supply:1.2V~3.6V Voltage - Supply:1.2V~3.6V Throughput Rate:10kHz Operating Temperature:-40℃~+85℃ Operating Temperature:-40℃~+85℃ Voltage; LCSC Part Name: TSC2007 触摸屏控制器; Supplier Part: C38398; Manufacturer: TI(德州仪器); Supplier Footprint: TSSOP-16; JLCPCB Part Class: Extended Part; Datasheet: https://www.ti.com/cn/lit/gpn/tsc2007; Supplier: LCSC; Touch Screen Type: 4-Wire Resistive; Resolution (Bits): 12; Interface: I2C; Gain Error: ±0.1LSB; Voltage - Supply: 1.2V~3.6V; Throughput Rate: 10kHz; Operating Temperature: -40℃~+85℃; Voltage Reference: External; Quiescent Current (Iq): 32.24uA; Integral non - linearity: 1.5LSB
U11 = BL8555-28PRA: Output Type:Fixed Voltage - Supply:8V Output Voltage:2.8V Output Voltage:2.8V Output Current:150mA Power Supply Rejection Ratio (PSRR):65dB@(1kHz) Operating Temperature:-40℃~+85℃@(Ta) Operating Temperature:-40℃~+85℃@(Ta); Supplier Part: C2834972; Manufacturer: BL(上海贝岭); Supplier Footprint: SOT-23-5; JLCPCB Part Class: Extended Part; Datasheet: https://atta.szlcsc.com/upload/public/pdf/source/20211010/C2834972_E1224AB6E0BDAF9C61CF715D306BCC2E.pdf; Supplier: LCSC; Output Type: Fixed; Voltage - Supply: 8V; Output Voltage: 2.8V; Output Current: 150mA; Power Supply Rejection Ratio (PSRR): 65dB@(1kHz); Operating Temperature: -40℃~+85℃@(Ta)
U12 = AP7343Q-18W5-7: Output Type:Fixed Voltage - Supply:5.25V Output Voltage:1.8V Output Voltage:1.8V Output Current:300mA Power Supply Rejection Ratio (PSRR):75dB@(1kHz) Voltage Dropout:460mV@(300mA) standby current:60uA Noise:60uVrms Features:Enable；Short Circuit Protection; LCSC Part Name: 输入5.25V 输出1.8V 300mA; Supplier Part: C3746471; Manufacturer: DIODES(美台); Supplier Footprint: SOT-25; JLCPCB Part Class: Extended Part; Datasheet: https://item.szlcsc.com/datasheet/AP7343Q-18W5-7/4313998.html; Supplier: LCSC; Output Type: Fixed; Voltage - Supply: 5.25V; Output Voltage: 1.8V; Output Current: 300mA; Power Supply Rejection Ratio (PSRR): 75dB@(1kHz); Voltage Dropout: 460mV@(300mA); standby current: 60uA; Noise: 60uVrms; Features: Enable；Short Circuit Protection; Operating Temperature: -40℃~+125℃@(Ta); Output Configuration: Positive; Number of Outputs: 1
C1 C66 = CL05A106MQ5NUNC: Capacitance:10uF Tolerance:±20% Tolerance:±20% Voltage Rating:6.3V Temperature Coefficient:X5R; LCSC Part Name: 10uF ±20% 6.3V; Supplier Part: C15525; Manufacturer: SAMSUNG(三星); Supplier Footprint: 0402; JLCPCB Part Class: Basic Part; Datasheet: https://item.szlcsc.com/datasheet/CL05A106MQ5NUNC/16204.html; Supplier: LCSC; Tolerance: ±20%; Voltage Rating: 6.3V; Temperature Coefficient: X5R
C_I2C = SM04B-SRSS-TB(LF)(SN): Pins Structure:1x4P Pitch:1mm Mounting Type:Surface Mount, Right Angle Reference Series:SH Number of Pins:4P Number of Rows:1 Number of PINs Per Row:4 Row Spacing:- Current Rating:1A Contact Material:Copper Alloy Contact Plating:Tin Operating Temperature:; LCSC Part Name: 1x4P 间距:1mm 卧贴 系列:SH; Supplier Part: C160404; Manufacturer: JST; Supplier Footprint: SMD,P=1mm,卧贴; JLCPCB Part Class: Extended Part; Datasheet: https://item.szlcsc.com/datasheet/SM04B-SRSS-TB(LF)(SN)/171784.html; Supplier: LCSC; Pins Structure: 1x4P; Pitch: 1mm; Mounting Type: Surface Mount, Right Angle; Reference Series: SH; Number of Pins: 4P; Number of Rows: 1; Number of PINs Per Row: 4; Current Rating: 1A; Contact Material: Copper Alloy; Contact Plating: Tin; Operating Temperature: -25℃~+85℃; Voltage Rating: 50V; Plastic Material: PA; Flame Retardant Rating: UL94V-0; Supplementary Features: Auxiliary Solder Pin; Color: White; Z-Height of the Board: 2.9mm; X-Length of Bottom Edge on Board (Spacing Line): 6mm; Y-Width of Bottom Edge on Board: 4.32mm
C_P0 = SM03B-SRSS-TB(LF)(SN): Pins Structure:1x3P Pitch:1mm Mounting Type:Surface Mount, Right Angle Reference Series:SH Number of Pins:3P Number of Rows:1 Number of PINs Per Row:3 Row Spacing:- Current Rating:1A Contact Material:Copper Alloy Contact Plating:Tin Operating Temperature:; LCSC Part Name: 1x3P 间距:1mm 卧贴 系列:SH; Supplier Part: C160403; Manufacturer: JST; Supplier Footprint: SMD,P=1mm,卧贴; JLCPCB Part Class: Extended Part; Datasheet: https://item.szlcsc.com/datasheet/SM03B-SRSS-TB(LF)(SN)/171783.html; Supplier: LCSC; Pins Structure: 1x3P; Pitch: 1mm; Mounting Type: Surface Mount, Right Angle; Reference Series: SH; Number of Pins: 3P; Number of Rows: 1; Number of PINs Per Row: 3; Current Rating: 1A; Contact Material: Copper Alloy; Contact Plating: Tin; Operating Temperature: -25℃~+85℃; Voltage Rating: 50V; Plastic Material: PA; Flame Retardant Rating: UL94V-0; Supplementary Features: Auxiliary Solder Pin; Color: White; Z-Height of the Board: 2.9mm; X-Length of Bottom Edge on Board (Spacing Line): 5mm; Y-Width of Bottom Edge on Board: 4.32mm
C_P1-3 = SM05B-SRSS-TB(LF)(SN): Pins Structure:1x5P Pitch:1mm Mounting Type:Surface Mount, Right Angle Reference Series:SH Number of Pins:5P Number of Rows:1 Number of PINs Per Row:5 Row Spacing:- Current Rating:1A Contact Material:Copper Alloy Contact Plating:Tin Operating Temperature:; LCSC Part Name: 1x5P 间距:1mm 卧贴 系列:SH; Supplier Part: C136657; Manufacturer: JST; Supplier Footprint: SMD,P=1mm,卧贴; JLCPCB Part Class: Extended Part; Datasheet: https://item.szlcsc.com/datasheet/SM05B-SRSS-TB(LF)(SN)/147973.html; Supplier: LCSC; Pins Structure: 1x5P; Pitch: 1mm; Mounting Type: Surface Mount, Right Angle; Reference Series: SH; Number of Pins: 5P; Number of Rows: 1; Number of PINs Per Row: 5; Current Rating: 1A; Contact Material: Copper Alloy; Contact Plating: Tin; Operating Temperature: -25℃~+85℃; Voltage Rating: 50V; Plastic Material: PA; Flame Retardant Rating: UL94V-0; Supplementary Features: Auxiliary Solder Pin; Color: White; Z-Height of the Board: 2.9mm; X-Length of Bottom Edge on Board (Spacing Line): 7mm; Y-Width of Bottom Edge on Board: 4.32mm
C_P4-7 = SM06B-SRSS-TB(LF)(SN): Pins Structure:1x6P Pitch:1mm Mounting Type:Surface Mount, Right Angle Reference Series:SH Number of Pins:6P Number of Rows:1 Number of PINs Per Row:6 Row Spacing:- Current Rating:1A Contact Material:Copper Alloy Contact Plating:Tin Operating Temperature:; LCSC Part Name: 1x6P 间距:1mm 卧贴 系列:SH; Supplier Part: C160405; Manufacturer: JST; Supplier Footprint: SMD,P=1mm,卧贴; JLCPCB Part Class: Extended Part; Datasheet: https://item.szlcsc.com/datasheet/SM06B-SRSS-TB(LF)(SN)/171785.html; Supplier: LCSC; Pins Structure: 1x6P; Pitch: 1mm; Mounting Type: Surface Mount, Right Angle; Reference Series: SH; Number of Pins: 6P; Number of Rows: 1; Number of PINs Per Row: 6; Current Rating: 1A; Contact Material: Copper Alloy; Contact Plating: Tin; Operating Temperature: -25℃~+85℃; Voltage Rating: 50V; Plastic Material: PA; Flame Retardant Rating: UL94V-0; Supplementary Features: Auxiliary Solder Pin; Color: White; Z-Height of the Board: 2.9mm; X-Length of Bottom Edge on Board (Spacing Line): 8mm; Y-Width of Bottom Edge on Board: 4.32mm
TF1 = TF-CARD H1.8: Card Connection Mode:Push-Push Card Type:MicroSD Card (TF Card) Connector Type:Connector and Ejector Additional Card Detection Pins:- Supplementary Features:- Height Above Board:1.8mm Operating Temperature:-40℃~+70℃ Operating Temperature:-40℃~+70℃; LCSC Part Name: 9P，自弹式TF卡座; Supplier Part: C7529389; Manufacturer: SHOU HAN(首韩); Supplier Footprint: SMD; JLCPCB Part Class: Extended Part; Datasheet: https://item.szlcsc.com/datasheet/TF-CARD%2520H1.8/8629776.html; Supplier: LCSC; Card Connection Mode: Push-Push; Card Type: MicroSD Card (TF Card); Connector Type: Connector and Ejector; Height Above Board: 1.8mm; Operating Temperature: -40℃~+70℃
U1 = ESP32-S3-WROOM-1-N16R8: LCSC Part Name: 通用型Wi-Fi+低功耗蓝牙MCU模组; Supplier Part: C2913202; Manufacturer: ESPRESSIF(乐鑫); Supplier Footprint: SMD,25.5x18mm; JLCPCB Part Class: Extended Part; Datasheet: https://item.szlcsc.com/datasheet/ESP32-S3-WROOM-1-N16R8/3198300.html; Supplier: LCSC
U2 = GT30L24A3W: Character Set:；KSC5601；UNICODE；JIS0208 Word Size: Clock Rate: Operating Voltage Range:2.7V~3.6V Operating Voltage Range:2.7V~3.6V Operating Current:12mA Operating Current:12mA Standby Current:5uA Standby Current:5uA Operating Temperature Range: Operating; LCSC Part Name: 标准点阵中外文字库芯片; Supplier Part: C124688; Manufacturer: GENITOP(高通); Supplier Footprint: SOIC-8-208mil; JLCPCB Part Class: Extended Part; Datasheet: https://atta.szlcsc.com/upload/public/pdf/source/20170914/C124688_1505374037785969001.pdf; Supplier: LCSC; Character Set: ；KSC5601；UNICODE；JIS0208; Operating Voltage Range: 2.7V~3.6V; Operating Current: 12mA; Standby Current: 5uA
C2 C45 = CL05A226MQ5QUNC: Capacitance:22uF Tolerance:±20% Tolerance:±20% Voltage Rating:6.3V Temperature Coefficient:X5R; LCSC Part Name: 22uF ±20% 6.3V; Supplier Part: C105226; Manufacturer: SAMSUNG(三星); Supplier Footprint: 0402; JLCPCB Part Class: Extended Part; Datasheet: https://item.szlcsc.com/datasheet/CL05A226MQ5QUNC/106441.html; Supplier: LCSC; Tolerance: ±20%; Voltage Rating: 6.3V; Temperature Coefficient: X5R
C6 C40 = GRM0335C1H150JA01D: Capacitance:15pF Tolerance:±5% Tolerance:±5% Voltage Rating:50V Temperature Coefficient:C0G; LCSC Part Name: 15pF ±5% 50V; Supplier Part: C85891; Manufacturer: muRata(村田); Supplier Footprint: 0201; JLCPCB Part Class: Extended Part; Datasheet: https://item.szlcsc.com/datasheet/GRM0335C1H150JA01D/87067.html; Supplier: LCSC; Tolerance: ±5%; Voltage Rating: 50V; Temperature Coefficient: C0G
MIC1 MIC2 = MSM381ACP003_C51928212: Direction:Omnidirectional Voltage - Supply:1.8V Voltage - Supply:1.8V Current Consumption:175uA Current Consumption:175uA S/N Ratio:64dB Sensitivity:-38dB Sensitivity:-38dB Impedance:170Ω Output Type:Analog output Length:2.75mm Width:1.85mm Height:1mm; Supplier Part: C51928212; Manufacturer: MEMS(敏芯微); Supplier Footprint: LGA-4(1.9x2.8); JLCPCB Part Class: Extended Part; Datasheet: https://item.szlcsc.com/datasheet/MSM381ACP003/54640767.html; Supplier: LCSC; Direction: Omnidirectional; Voltage - Supply: 1.8V; Current Consumption: 175uA; S/N Ratio: 64dB; Sensitivity: -38dB; Impedance: 170Ω; Output Type: Analog output; Length: 2.75mm; Width: 1.85mm; Height: 1mm
R21 = 0201WMF3301TEE: Type:Thick Film Resistor Resistance:3.3kΩ Tolerance:±1% Tolerance:±1% Power(Watts):50mW Voltage-Supply(Max):25V Temperature Coefficient:±200ppm/℃ Temperature Coefficient:±200ppm/℃ Operating Temperature:-55℃~+155℃ Operating Temperature:-55℃~+155℃; LCSC Part Name: 3.3kΩ ±1% 50mW 厚膜电阻; Supplier Part: C270350; Manufacturer: UNI-ROYAL(厚声); Supplier Footprint: 0201; JLCPCB Part Class: Extended Part; Datasheet: https://item.szlcsc.com/datasheet/0201WMF3301TEE/259880.html; Supplier: LCSC; Type: Thick Film Resistor; Tolerance: ±1%; Power(Watts): 50mW; Voltage-Supply(Max): 25V; Temperature Coefficient: ±200ppm/℃; Operating Temperature: -55℃~+155℃
SP1 = SM02B-SRSS-TB(LF)(SN): Pins Structure:1x2P Pitch:1mm Mounting Type:Surface Mount, Right Angle Reference Series:SH Number of Pins:2P Number of Rows:1 Number of PINs Per Row:2 Row Spacing:- Current Rating:1A Contact Material:Copper Alloy Contact Plating:Tin Operating Temperature:; LCSC Part Name: 1x2P 间距:1mm 卧贴 系列:SH; Supplier Part: C160402; Manufacturer: JST; Supplier Footprint: SMD,P=1mm,卧贴; JLCPCB Part Class: Extended Part; Datasheet: https://item.szlcsc.com/datasheet/SM02B-SRSS-TB(LF)(SN)/171782.html; Supplier: LCSC; Pins Structure: 1x2P; Pitch: 1mm; Mounting Type: Surface Mount, Right Angle; Reference Series: SH; Number of Pins: 2P; Number of Rows: 1; Number of PINs Per Row: 2; Current Rating: 1A; Contact Material: Copper Alloy; Contact Plating: Tin; Operating Temperature: -25℃~+85℃; Voltage Rating: 50V; Plastic Material: PA; Flame Retardant Rating: UL94V-0; Supplementary Features: Auxiliary Solder Pin; Color: White; Z-Height of the Board: 2.9mm; X-Length of Bottom Edge on Board (Spacing Line): 4mm; Y-Width of Bottom Edge on Board: 4.32mm
U13 = NS4168_C910588: Class:Class D Output Power:2.5Wx1@4Ω Voltage - Supply:3V~5.5V Voltage - Supply:3V~5.5V; Supplier Part: C910588; Manufacturer: Nsiway(纳芯威); Supplier Footprint: ESOP-8-EP(3.9x4.9x1.27); JLCPCB Part Class: Extended Part; Datasheet: https://item.szlcsc.com/datasheet/NS4168/978904.html; Supplier: LCSC; Class: Class D; Output Power: 2.5Wx1@4Ω; Voltage - Supply: 3V~5.5V
U14 = ES7243E: Resolution:24 Number of Channels:16 Voltage - Supply:1.7V~3.6V Voltage - Supply:1.7V~3.6V Interface Type:I2S Chip Type Parameters/Description:Stereo Audio ADC Operating Temperature:-40℃~+85℃ Operating Temperature:-40℃~+85℃; Supplier Part: C2929446; Manufacturer: Everest-semi(顺芯); Supplier Footprint: QFN-20; JLCPCB Part Class: Extended Part; Datasheet: https://item.szlcsc.com/datasheet/ES7243E/3264523.html; Supplier: LCSC; Resolution: 24; Number of Channels: 16; Voltage - Supply: 1.7V~3.6V; Interface Type: I2S; Chip Type Parameters/Description: Stereo Audio ADC; Operating Temperature: -40℃~+85℃
BATT = PH-2P卧贴: Pins Structure:1x2P Pitch:2mm Mounting Type:Surface Mount, Right Angle Reference Series:PH Number of Pins:2P Number of Rows:1 Number of PINs Per Row:2 Row Spacing:- Current Rating:2A Contact Material:Brass Contact Plating:Tin Operating Temperature:-25℃~+8; LCSC Part Name: 1x2P 间距:2mm 卧贴 系列:PH; Supplier Part: C47647; Manufacturer: BOOMELE(博穆精密); Supplier Footprint: SMD,P=2mm,卧贴; JLCPCB Part Class: Extended Part; Datasheet: https://item.szlcsc.com/datasheet/PH-2P%25E5%258D%25A7%25E8%25B4%25B4/48652.html; Supplier: LCSC; Pins Structure: 1x2P; Pitch: 2mm; Mounting Type: Surface Mount, Right Angle; Reference Series: PH; Number of Pins: 2P; Number of Rows: 1; Number of PINs Per Row: 2; Current Rating: 2A; Contact Material: Brass; Contact Plating: Tin; Operating Temperature: -25℃~+85℃; Voltage Rating: 250V; Plastic Material: PA; Flame Retardant Rating: UL94V-0; Color: Beige
C51 C52 C59 C60 = GRM155R61A106ME44D: Capacitance:10uF Tolerance:±20% Tolerance:±20% Voltage Rating:10V Temperature Coefficient:X5R; LCSC Part Name: 10uF ±20% 10V; Supplier Part: C77000; Manufacturer: muRata(村田); Supplier Footprint: 0402; JLCPCB Part Class: Extended Part; Datasheet: https://item.szlcsc.com/datasheet/GRM155R61A106ME44D/78127.html; Supplier: LCSC; Tolerance: ±20%; Voltage Rating: 10V; Temperature Coefficient: X5R
C54 = CL05A105KA5NQNC: Capacitance:1uF Tolerance:±10% Tolerance:±10% Voltage Rating:25V Temperature Coefficient:X5R; LCSC Part Name: 1uF ±10% 25V; Supplier Part: C52923; Manufacturer: SAMSUNG(三星); Supplier Footprint: 0402; JLCPCB Part Class: Basic Part; Datasheet: https://item.szlcsc.com/datasheet/CL05A105KA5NQNC/53938.html; Supplier: LCSC; Tolerance: ±10%; Voltage Rating: 25V; Temperature Coefficient: X5R
C56-C58 C61 = CL05B104KO5NNNC: Capacitance:100nF Tolerance:±10% Tolerance:±10% Voltage Rating:16V Temperature Coefficient:X7R; LCSC Part Name: 100nF ±10% 16V; Supplier Part: C1525; Manufacturer: SAMSUNG(三星); Supplier Footprint: 0402; JLCPCB Part Class: Basic Part; Datasheet: https://item.szlcsc.com/datasheet/CL05B104KO5NNNC/1877.html; Supplier: LCSC; Tolerance: ±10%; Voltage Rating: 16V; Temperature Coefficient: X7R
D2 = SS34_C8678: Diode Configuration:Independent Voltage - Forward(Vf@If):550mV@3A Voltage - DC Reverse(Vr):40V Current - Rectified:3A Reverse Leakage Current (Ir):500uA@40V Operating Junction Temperature Range:-55℃~+125℃ Operating Junction Temperature Range:-55℃~+125℃; LCSC Part Name: 电压:40V 电流:3A; Supplier Part: C8678; Manufacturer: MDD(辰达半导体); Supplier Footprint: SMA(DO-214AC); JLCPCB Part Class: Basic Part; Datasheet: https://item.szlcsc.com/datasheet/SS34/9178.html; Supplier: LCSC; Diode Configuration: Independent; Voltage - Forward(Vf@If): 550mV@3A; Voltage - DC Reverse(Vr): 40V; Current - Rectified: 3A; Reverse Leakage Current (Ir): 500uA@40V; Operating Junction Temperature Range: -55℃~+125℃
D5 D6 = PTVSUC3D5VB: Supplier Part: C918847; Manufacturer: Prisemi(芯导); Supplier Footprint: SOD-323; JLCPCB Part Class: Extended Part; Datasheet: https://item.szlcsc.com/datasheet/PTVSUC3D5VB/995668.html; Supplier: LCSC
L1 = SM3521-2R2MT: Inductance: Tolerance:±20% Tolerance:±20% Rated Current: Saturation Current (Isat):2.3A DC Resistance (DCR):; LCSC Part Name: 2.2uH ±20% 2.3A; Supplier Part: C9890; Manufacturer: SXN(顺翔诺); Supplier Footprint: SMD; JLCPCB Part Class: Extended Part; Datasheet: https://atta.szlcsc.com/upload/public/pdf/source/20210810/DE909F839CF261ABDAA312DFDF4FA1A6.pdf; Supplier: LCSC; Tolerance: ±20%; Saturation Current (Isat): 2.3A
Q2 = AO3401A_C15127: Number:1 P-Channel Drain to Source Voltage:30V Current - Continuous Drain(Id):4A RDS(on):47mΩ@10V；85mΩ@2.5V；60mΩ@4.5V Pd - Power Dissipation:- Gate Threshold Voltage (Vgs(th)):900mV@250uA Gate Charge(Qg):14nC@10V Input Capacitance(Ciss):645pF Reverse Tran; LCSC Part Name: 1个P沟道 耐压:30V 电流:4A; Supplier Part: C15127; Manufacturer: AOS; Supplier Footprint: SOT-23; JLCPCB Part Class: Basic Part; Datasheet: https://item.szlcsc.com/datasheet/AO3401A/15801.html; Supplier: LCSC; Number: 1 P-Channel; Drain to Source Voltage: 30V; Current - Continuous Drain(Id): 4A; RDS(on): 47mΩ@10V；85mΩ@2.5V；60mΩ@4.5V; Gate Threshold Voltage (Vgs(th)): 900mV@250uA; Gate Charge(Qg): 14nC@10V; Input Capacitance(Ciss): 645pF; Reverse Transfer Capacitance (Crss@Vds): 55pF; Output Capacitance(Coss): 80pF
Q3 = BCM857BS: Current - Collector(Ic):200mA Collector - Emitter Voltage VCEO:45V Pd - Power Dissipation:300mW DC Current Gain:420@2mA,5V DC Current Gain:420@2mA,5V Transition frequency(fT):200MHz Current - Collector Cutoff:15nA Vce Saturation(VCE(sat)):650mV@100mA,5mA; LCSC Part Name: 电流:0.2A 电压:45V; Supplier Part: C20426291; Manufacturer: FUXINSEMI(富芯森美); Supplier Footprint: SOT-363; JLCPCB Part Class: Extended Part; Datasheet: https://item.szlcsc.com/datasheet/BCM857BS/21764640.html; Supplier: LCSC; Current - Collector(Ic): 200mA; Collector - Emitter Voltage VCEO: 45V; Pd - Power Dissipation: 300mW; DC Current Gain: 420@2mA,5V; Transition frequency(fT): 200MHz; Current - Collector Cutoff: 15nA; Vce Saturation(VCE(sat)): 650mV@100mA,5mA; Emitter-Base Voltage(Vebo): 5V
R2 = 0201WMF1001TEE: Type:Thick Film Resistor Resistance:1kΩ Tolerance:±1% Tolerance:±1% Power(Watts):50mW Voltage-Supply(Max):25V Temperature Coefficient:±200ppm/℃ Temperature Coefficient:±200ppm/℃ Operating Temperature:-55℃~+155℃ Operating Temperature:-55℃~+155℃; LCSC Part Name: 1kΩ ±1% 50mW 厚膜电阻; Supplier Part: C270365; Manufacturer: UNI-ROYAL(厚声); Supplier Footprint: 0201; JLCPCB Part Class: Extended Part; Datasheet: https://item.szlcsc.com/datasheet/0201WMF1001TEE/259895.html; Supplier: LCSC; Type: Thick Film Resistor; Tolerance: ±1%; Power(Watts): 50mW; Voltage-Supply(Max): 25V; Temperature Coefficient: ±200ppm/℃; Operating Temperature: -55℃~+155℃
R3 R5 = 0201WMF5101TEE: Type:Thick Film Resistor Resistance:5.1kΩ Tolerance:±1% Tolerance:±1% Power(Watts):50mW Voltage-Supply(Max):25V Temperature Coefficient:±200ppm/℃ Temperature Coefficient:±200ppm/℃ Operating Temperature:-55℃~+155℃ Operating Temperature:-55℃~+155℃; LCSC Part Name: 5.1kΩ ±1% 50mW 厚膜电阻; Supplier Part: C270344; Manufacturer: UNI-ROYAL(厚声); Supplier Footprint: 0201; JLCPCB Part Class: Extended Part; Datasheet: https://item.szlcsc.com/datasheet/0201WMF5101TEE/259874.html; Supplier: LCSC; Type: Thick Film Resistor; Tolerance: ±1%; Power(Watts): 50mW; Voltage-Supply(Max): 25V; Temperature Coefficient: ±200ppm/℃; Operating Temperature: -55℃~+155℃
R23 = 0201WMF2702TEE: Type:Thick Film Resistor Resistance:27kΩ Tolerance:±1% Tolerance:±1% Power(Watts):50mW Voltage-Supply(Max):25V Temperature Coefficient:±200ppm/℃ Temperature Coefficient:±200ppm/℃ Operating Temperature:-55℃~+155℃ Operating Temperature:-55℃~+155℃; LCSC Part Name: 27kΩ ±1% 50mW 厚膜电阻; Supplier Part: C270351; Manufacturer: UNI-ROYAL(厚声); Supplier Footprint: 0201; JLCPCB Part Class: Extended Part; Datasheet: https://item.szlcsc.com/datasheet/0201WMF2702TEE/259881.html; Supplier: LCSC; Type: Thick Film Resistor; Tolerance: ±1%; Power(Watts): 50mW; Voltage-Supply(Max): 25V; Temperature Coefficient: ±200ppm/℃; Operating Temperature: -55℃~+155℃
R25 R26 = 0201WMF1003TEE: Type:Thick Film Resistors Resistance:100kΩ Tolerance:±1% Tolerance:±1% Power(Watts): Overload Voltage (Max): Temperature Coefficient:±200ppm/℃ Temperature Coefficient:±200ppm/℃ Operating Temperature Range:-55℃~+155℃ Operating Temperature Range:-55℃~+155℃; LCSC Part Name: 100kΩ ±1% 50mW 厚膜电阻; Supplier Part: C270364; Manufacturer: UNI-ROYAL(厚声); Supplier Footprint: 0201; JLCPCB Part Class: Extended Part; Datasheet: https://atta.szlcsc.com/upload/public/pdf/source/20200306/C422600_1E6D84923E4A46A82E41ADD87F860B5C.pdf; Supplier: LCSC; Type: Thick Film Resistors; Tolerance: ±1%; Temperature Coefficient: ±200ppm/℃; Operating Temperature Range: -55℃~+155℃
R42 = 0402WGF0000TCE: Type:Thick Film Resistor Resistance:0Ω Tolerance:±1% Tolerance:±1% Power(Watts):62.5mW Voltage-Supply(Max):50V Temperature Coefficient:±800ppm/℃ Temperature Coefficient:±800ppm/℃ Operating Temperature:-55℃~+155℃ Operating Temperature:-55℃~+155℃; LCSC Part Name: 0Ω ±1% 62.5mW 厚膜电阻; Supplier Part: C17168; Manufacturer: UNI-ROYAL(厚声); Supplier Footprint: 0402; JLCPCB Part Class: Basic Part; Datasheet: https://item.szlcsc.com/datasheet/0402WGF0000TCE/17853.html; Supplier: LCSC; Type: Thick Film Resistor; Tolerance: ±1%; Power(Watts): 62.5mW; Voltage-Supply(Max): 50V; Temperature Coefficient: ±800ppm/℃; Operating Temperature: -55℃~+155℃
U3 = PUSB2X4Y: Polarity:Unidirectional Reverse Stand-Off Voltage (Vrwm):5.5V Clamping Voltage:14V Peak Pulse Power Dissipation (Ppp):50W@8/20us Voltage - Breakdown:8.5V Reverse Leakage Current (Ir):10nA Operating Temperature:-55℃~+125℃ Operating Temperature:-55℃~+125℃ l; LCSC Part Name: 单向TVS 5.5V截止; Supplier Part: C2905617; Manufacturer: TECH PUBLIC(台舟); Supplier Footprint: SOT-363; JLCPCB Part Class: Extended Part; Datasheet: https://item.szlcsc.com/datasheet/PUSB2X4Y/3175914.html; Supplier: LCSC; Polarity: Unidirectional; Reverse Stand-Off Voltage (Vrwm): 5.5V; Clamping Voltage: 14V; Peak Pulse Power Dissipation (Ppp): 50W@8/20us; Voltage - Breakdown: 8.5V; Reverse Leakage Current (Ir): 10nA; Operating Temperature: -55℃~+125℃; level of protection: IEC 61000-4-4；IEC 61000-4-5；IEC 61000-4-2; Type: TVS; Junction Capacitance: 0.9pF
U4 = JW3651QFNE#TRPBF: Supplier Part: C5444670; Manufacturer: Joulwatt(杰华特); Supplier Footprint: QFN-15(3x4); JLCPCB Part Class: Extended Part; Supplier: LCSC
U17 = MCP73831T-2ACI/OT: The Chip Type:Charging IC Voltage - Supply:3.75V~6V Voltage - Supply:3.75V~6V Charge Current - Max:550mA Charging Saturation Voltage:4.2V Type of Battery:Lithium Battery Number of Cells:1 Number of Cells:1 Operating Temperature:-40℃~+85℃ Operating Tempera; LCSC Part Name: 单节锂离子/锂聚合物充电管理控制器; Supplier Part: C424093; Manufacturer: MICROCHIP(美国微芯); Supplier Footprint: SOT-23-5; JLCPCB Part Class: Extended Part; Datasheet: https://item.szlcsc.com/datasheet/MCP73831T-2ACI%252FOT/417116.html; Supplier: LCSC; The Chip Type: Charging IC; Voltage - Supply: 3.75V~6V; Charge Current - Max: 550mA; Charging Saturation Voltage: 4.2V; Type of Battery: Lithium Battery; Number of Cells: 1; Operating Temperature: -40℃~+85℃; Supply Current (Iq): 53uA
USB1 = USB-TYPE-C-018: Connector Type:Type-C Protocol Standard:- Gender:Female Mounting Type:Surface Mount, Right Angle Number of Contacts:16P Number of Ports:1 Current Rating-Power:3A Voltage Rating:5V Connect-Disconnect Life:10,000 cycles Length:7.35mm Operating Temperature:-; LCSC Part Name: Type-C 母 卧贴; Supplier Part: C2927038; Manufacturer: DEALON(德艺隆); Supplier Footprint: SMD; JLCPCB Part Class: Extended Part; Datasheet: https://item.szlcsc.com/datasheet/USB-TYPE-C-018/3252507.html; Supplier: LCSC; Connector Type: Type-C; Gender: Female; Mounting Type: Surface Mount, Right Angle; Number of Contacts: 16P; Number of Ports: 1; Current Rating-Power: 3A; Voltage Rating: 5V; Connect-Disconnect Life: 10,000 cycles; Length: 7.35mm; Operating Temperature: -25℃~+85℃
HUM = AHT20: Temperature Range:-40℃~+120℃ Temperature Range:-40℃~+120℃ Humidity:0%RH~100%RH Humidity:0%RH~100%RH Interface:I2C Voltage - Supply:2.2V~5.5V Voltage - Supply:2.2V~5.5V Current - Supply:570uA Humidity Tolerance:±2%RH Humidity Tolerance:±2%RH Temperature To; LCSC Part Name: 温湿度传感器 完全标定 数字输出 I2C 接口; Supplier Part: C2757850; Manufacturer: 广州奥松; Supplier Footprint: SMD; JLCPCB Part Class: Extended Part; Datasheet: https://item.szlcsc.com/datasheet/AHT20/2874650.html; Supplier: LCSC; Temperature Range: -40℃~+120℃; Humidity: 0%RH~100%RH; Interface: I2C; Voltage - Supply: 2.2V~5.5V; Current - Supply: 570uA; Humidity Tolerance: ±2%RH; Temperature Tolerance: ±0.3℃; Resolution: 20bit
LS = LTR-303ALS-01: Supplier Part: C364577; Manufacturer: LITEON(光宝); Supplier Footprint: DFN-6(2x2); JLCPCB Part Class: Extended Part; Datasheet: https://atta.szlcsc.com/upload/public/pdf/source/20190228/C364577_22D9C2451404EB1C918B95CD5CAED65B.pdf; Supplier: LCSC
U5 = SC7A20HTR: Accelerometer Sensing Axis:X,Y,Z Acceleration Measurement Range (MAX):±16g Acceleration Measurement Range (MAX):±16g Sensor Type:Accelerometer Interface:I2C；SPI Voltage - Supply:1.71V~3.6V Voltage - Supply:1.71V~3.6V Standby Current:500nA Operating Temper; LCSC Part Name: ±2G/±4G/±8G/±16G三轴微机械数字加速度计; Supplier Part: C19274408; Manufacturer: SILAN(士兰微); Supplier Footprint: LGA-12(2x2); JLCPCB Part Class: Extended Part; Datasheet: https://item.szlcsc.com/datasheet/SC7A20HTR/20603496.html; Supplier: LCSC; Accelerometer Sensing Axis: X,Y,Z; Acceleration Measurement Range (MAX): ±16g; Sensor Type: Accelerometer; Interface: I2C；SPI; Voltage - Supply: 1.71V~3.6V; Standby Current: 500nA; Operating Temperature: -40℃~+85℃
U8 = SLS32AIA020X2USON10: CPU Core:Other Series Program Storage Size:10KB Voltage - Supply:1.62V~5.5V Voltage - Supply:1.62V~5.5V Applications:-; LCSC Part Name: 具备DTLS通信和I2C接口的安全控制器; Supplier Part: C2651743; Manufacturer: Infineon(英飞凌); Supplier Footprint: USON-10; JLCPCB Part Class: Extended Part; Datasheet: https://item.szlcsc.com/datasheet/SLS32AIA020X2USON10/2743652.html; Supplier: LCSC; CPU Core: Other Series; Program Storage Size: 10KB; Voltage - Supply: 1.62V~5.5V
U9 = XL9535QF24: Interface:I2C；SMBus Number of I/O:16 Interrupt Output:With Interrupt Output Output Type:- Voltage - Supply:2.3V~5.5V Voltage - Supply:2.3V~5.5V Current - Output Low(IOL):- Current - Output High(IOH):- Clock Frequency:400kHz Operating Temperature:-40℃~+85℃; LCSC Part Name: 16位I²C总线和SMBus I/O端口扩展器，带中断输出和配置寄存器; Supplier Part: C5444301; Manufacturer: XINLUDA(信路达); Supplier Footprint: QFN-24(4x4); JLCPCB Part Class: Extended Part; Datasheet: https://item.szlcsc.com/datasheet/XL9535QF24/6334561.html; Supplier: LCSC; Interface: I2C；SMBus; Number of I/O: 16; Interrupt Output: With Interrupt Output; Voltage - Supply: 2.3V~5.5V; Clock Frequency: 400kHz; Operating Temperature: -40℃~+85℃
U18 = SE050C2HQ1/Z01SDZ: LCSC Part Name: 即插即用安全元件; Supplier Part: C2659345; Manufacturer: NXP(恩智浦); Supplier Footprint: WQFN-20-EP(3x3); JLCPCB Part Class: Extended Part; Datasheet: https://www.nxp.com/docs/en/data-sheet/SE050-DATASHEET.pdf; Supplier: LCSC

## Nets
1V8: C50.2 FPC3.15 U12.5(VOUT)
2V8: C47.2 FPC3.14 FPC3.21 U11.5(VOUT)
3V3: C1.2 C2.2 C12.2 C18.2 C19.2 C22.2 C23.2 C24.2 C26.2 C29.2 C30.2 C36.2 C37.2 C41.2 C45.2 C46.2 C48.2 C59.2 C60.2 C61.2 C62.2 C63.2 C64.2 C65.2 C_I2C.1 C_P0.1 C_P1-3.1 C_P4-7.1 FPC1.9 FPC1.10 FPC2.1 HUM.2(VDD) LS.1(VDD) MIC1.1(VDD) MIC2.1(VDD) R1.2 R4.2 R6.2 R7.2 R12.1 R13.2 R14.2 R15.2 R20.2 R23.2 R29.2 R31.1 R33.1 R34.2 R35.1 R36.2 R37.2 R38.2 R39.2 R43.2 RGB1.4(VDD) RGB2.4(VDD) TF1.4(VDD) U1.2(3V3) U2.8(VCC) U4.4(VO) U5.3(VDDIO) U5.7(VDD) U8.10(VCC) U9.21(VCC) U10.1(VDDREF) U11.1(VDD) U11.3(CE) U12.1(VIN) U12.3(EN) U13.1(CTRL) U13.6(VDD) U14.1(VDDP) U14.5(VDDD) U14.12(VDDA) U14.17(AD0) U18.12(VIN)
AGND: C6.1 C18.1 C26.1 C28.2 C36.1 C37.1 C39.2 C40.1 C42.1 C43.1 MIC1.3(GND) MIC1.4(GND) MIC2.3(GND) MIC2.4(GND) R22.1
GND: BATT.1 BATT.3 BATT.4 BOOT.1 C1.1 C2.1 C3.1 C12.1 C19.1 C20.1 C21.1 C22.1 C23.1 C24.1 C25.1 C29.1 C30.1 C41.1 C45.1 C46.1 C47.1 C48.1 C50.1 C51.1 C52.1 C54.2 C58.1 C59.1 C60.1 C61.1 C62.1 C63.1 C64.1 C65.1 C66.1 C67.1 C_I2C.2 C_I2C.5 C_I2C.6 C_P0.2 C_P0.4 C_P0.5 C_P1-3.2 C_P1-3.6 C_P1-3.7 C_P4-7.2 C_P4-7.7 C_P4-7.8 D5.1 FPC1.11 FPC1.12 FPC1.18 FPC1.19 FPC1.20 FPC2.6 FPC2.7 FPC2.8 FPC3.10 FPC3.23 FPC3.25 FPC3.26 HUM.5(GND) IND.1(K) LS.3(GND) PB1.1 PB1.3 PB1.4 PB2.2 PB2.3 PB2.4 PWR.1(K) Q4.2(E) Q5.2(E) R3.1 R5.2 R18.1 R21.2 R22.2 R24.2 R25.1 R26.1 R27.1 R32.2 R40.1 R42.2 RGB1.2(GND) RGB2.2(GND) RST.2 SP1.3 SP1.4 SW1.3 SW1.4 SW2.3 SW2.4 SW3.3 SW3.4 TF1.6(VSS) TF1.10(GND) TF1.11(GND) TF1.12(GND) TF1.13(GND) U1.1(GND) U1.40(GND) U1.41(GND) U2.4(GND) U3.2(GND) U4.1(CSP) U4.3(PGND) U4.6(OLIM) U4.12(TEST) U4.14(GND) U5.4(NC) U5.8(GNDIO) U5.9(GND) U8.1(GND) U8.2(GND) U8.4(GND) U8.5(GND) U8.6(GND) U8.7(GND) U8.11(EP) U9.9(GND) U9.18(A0) U9.23(A1) U9.24(A2) U9.25(EP) U10.6(GND) U10.13(A1) U10.14(A0) U11.2(GND) U12.2(GND) U13.7(GND) U13.9(EP) U14.4(GNDD) U14.8(AD1) U14.13(GNDA) U14.21(EP) U17.2(VSS) U18.1(ISO14443LB) U18.17(ISO14443LA) U18.19(VSS) U18.21(EP) USB1.0(SH) USB1.1(SH) USB1.2(SH) USB1.3(SH) USB1.A1(GND) USB1.A12(GND) USB1.B1(GND) USB1.B12(GND)
VBAT: BATT.2 C66.2 D5.2 Q2.3(D) Q3.1(E1) U17.3(VBAT)
VBUS: D2.2(A) R2.1 U17.4(VDD) USB1.A4(VBUS) USB1.A9(VBUS) USB1.B4(VBUS) USB1.B9(VBUS)
VCC: C51.2 C52.2 C58.2 D2.1(K) D6.1 Q2.2(S) Q3.4(E2) U4.2(VIN) U4.7(EN)
BOOT: BOOT.2 R4.1 U1.27(IO0) U13.3(BCLK) U14.6(SCLK)
BUS_INT: R14.1 U1.37(TXD0) U9.22(INT#)
C_D2: FPC3.6 U1.12(IO8)
C_D3: FPC3.4 U1.18(IO10)
C_D4: FPC3.3 U1.19(IO11)
C_D5: FPC3.5 U1.17(IO9)
C_D6: FPC3.7 U1.11(IO18)
C_D7: FPC3.9 U1.9(IO16)
C_D8: FPC3.11 U1.8(IO15)
C_D9: FPC3.13 U1.6(IO6)
C_HREF: FPC3.16 U1.5(IO5)
C_PCLK: FPC3.8 U1.10(IO17)
C_RST: FPC3.19 U9.3(P02)
C_VSYC: FPC3.18 U1.4(IO4)
C_XCLK: FPC3.12 U1.7(IO7)
CC1: R5.1 U3.3(IO) USB1.A5(CC1)
CC2: R3.2 U3.1(IO) USB1.B5(CC2)
CS3: R28.2 TF1.2(CD/DAT3) U1.33(IO40)
DN: U1.13(IO19) U3.4(IO) USB1.A7(DN1) USB1.B7(DN2)
DP: U1.14(IO20) U3.6(IO) USB1.A6(DP1) USB1.B6(DP2)
I2S_LRCK: U1.31(IO38) U13.2(LRCLK) U14.7(LRCK)
I2S_MCLK: U1.15(IO3) U14.20(MCLK)
I2S_SDI: U1.26(IO45) U13.4(SDATA)
I2S_SDO: R21.1 U1.32(IO39) U14.3(SDOUT/AD2)
LCD_BLK: R19.2 U9.1(P00)
LCD_CS: FPC1.14 U1.22(IO14)
LCD_DC: FPC1.15 U1.21(IO13)
LCD_MOSI: FPC1.13 U1.23(IO21)
LCD_SCLK: FPC1.16 U1.20(IO12)
MISO3: TF1.7(DAT0) U1.34(IO41) U2.2(SO)
MOSI3: TF1.3(CMD) U1.35(IO42) U2.5(SI)
P0: C_P0.3 U1.39(IO1)
P1: C_P1-3.3 U9.8(P07)
P2: C_P1-3.4 U9.16(P16)
P3: C_P1-3.5 U9.15(P15)
P4: C_P4-7.3 U9.14(P14)
P5: C_P4-7.4 U9.13(P13)
P6: C_P4-7.5 U9.10(P10)
P7: C_P4-7.6 R39.1 SW3.1 SW3.2 U9.11(P11)
P8: R37.1 SW1.1 SW1.2 U9.12(P12)
P9: R38.1 SW2.1 SW2.2 U9.5(P04)
P10: C21.2 PB1.2 R7.1 U9.6(P05)
P11: C20.2 PB2.1 R6.1 U9.7(P06)
RGB: RGB1.3(DIN) U1.16(IO46)
RST: C3.2 R1.1 RST.1 U1.3(EN)
SCL: C_I2C.3 FPC2.3 FPC3.20 HUM.3(SCL) LS.4(SCL) R13.1 R34.1 R36.1 U1.25(IO48) U5.12(SCx) U8.8(SCL) U9.19(SCL) U10.12(SCL) U14.19(CCLK) U18.10(l2C_SCL)
SCLK3: TF1.5(CLK) U1.36(RXD0) U2.6(SCLK)
SDA: C_I2C.4 FPC2.2 FPC3.22 HUM.4(SDA) LS.6(SDA) R12.2 R33.2 R35.2 U1.24(IO47) U5.2(SDx) U8.3(SDA) U9.20(DA) U10.11(SDA) U14.18(CDATA) U18.9(l2C_SDA)
SE_RST: U8.9(RST) U9.4(P03) U18.14(ISO7816RST_N)
TS_INT: FPC2.4 U1.38(IO2) U10.10(PENIRQ)
TS_RST: FPC2.5 U9.2(P01)
U_LED: R16.1 U9.17(P17)
VLDO: C54.1 U4.13(VCC) U4.15(CSN)
X+: FPC1.4 U10.2(X+)
X-: FPC1.2 U10.4(X-)
Y+: FPC1.3 U10.3(Y+)
Y-: FPC1.1 U10.5(Y-)
$1N44281: Q5.1(B) R27.2 R28.1
$1N44298: Q5.3(C) R29.1 U2.1(CS#)
$1N44462: R31.2 U2.7(HOLD#)
$2N1472: C56.1 U4.11(BST2)
$2N1473: C57.1 U4.8(BST1)
$2N1474: C57.2 L1.2 U4.9(SW1)
$2N1475: C56.2 L1.1 U4.10(SW2)
$2N1478: R23.1 R24.1 U4.5(FB)
$2N1482: Q3.2(B1) Q3.5(B2) Q3.6(C1) R25.2
$2N1494: D6.2 Q2.1(G) Q3.3(C2) R26.2
$2N4221: LED1.2(A) R2.2
$2N4223: LED1.1(K) U17.1(STAT)
$2N4224: R40.2 R41.1 U17.5(PROG)
$2N4225: R41.2 R42.1
$3N4430: C67.2 U18.15(VOUT) U18.18(VCC)
$3N4515: R43.1 U18.11(ENA)
$4N855: FPC1.5 FPC1.6 FPC1.7 FPC1.8 R17.2
$4N856: Q4.3(C) R17.1
$4N857: Q4.1(B) R18.2 R19.1
$4N864: C25.2 FPC1.17 R20.1
$4N2005: FPC3.17 R32.1
$5N1165: PWR.2(A) R15.1
$5N1166: IND.2(A) R16.2
$5N3637: RGB1.1(DOUT) RGB2.3(DIN)
$6N1541: C6.2 C27.2 MIC1.2(OUT)
$6N1543: C27.1 U14.9(AINLP)
$6N1544: C28.1 U14.10(AINLN)
$6N1560: C38.2 C40.2 MIC2.2(OUT)
$6N1562: C39.1 U14.15(AINRN)
$6N1563: C38.1 U14.16(AINRP)
$6N1575: C42.2 U14.11(REFQ)
$6N1576: C43.2 U14.14(REFP)
Net-(SP1-1): SP1.1 U13.5(VON)
Net-(SP1-2): SP1.2 U13.8(VOP)

Not connected (* = marked no-connect by the designer): FPC3 1 2 24; HUM 1(NC) 6(NC); LS 2(NC) 5(INT); RGB2 1(DOUT); TF1 1(DAT2) 8(DAT1) 9(CD); U1 28(IO35) 29(IO36) 30(IO37); U2 3(NC); U3 5(NC); U5 1(SDO) 5(INT1) 6(INT2) 10(CS) 11(NC); U10 7(NC/2) 8(NC/4) 9(NC) 15(NC/3) 16(AUX); U11 4(NC); U12 4(NC); U14 2(TDMIN); U18 2(n.c.) 3(ISO7816IO1) 4(n.c.) 5(n.c.) 6(n.c.) 7(n.c.) 8(n.c.) 13(ISO7816CLK) 16(ISO7816IO2) 20(n.c.); USB1 A8(SBU1) B8(SBU2)

## Notes on the sheets
sheet 4
- ONLY RESISTIVE TOUCH
- ONLY CAPACITIVE TOUCH
